# EAGLE design intertubeClock (EAGLE 7.6.0)

## Sheet 1 of 4
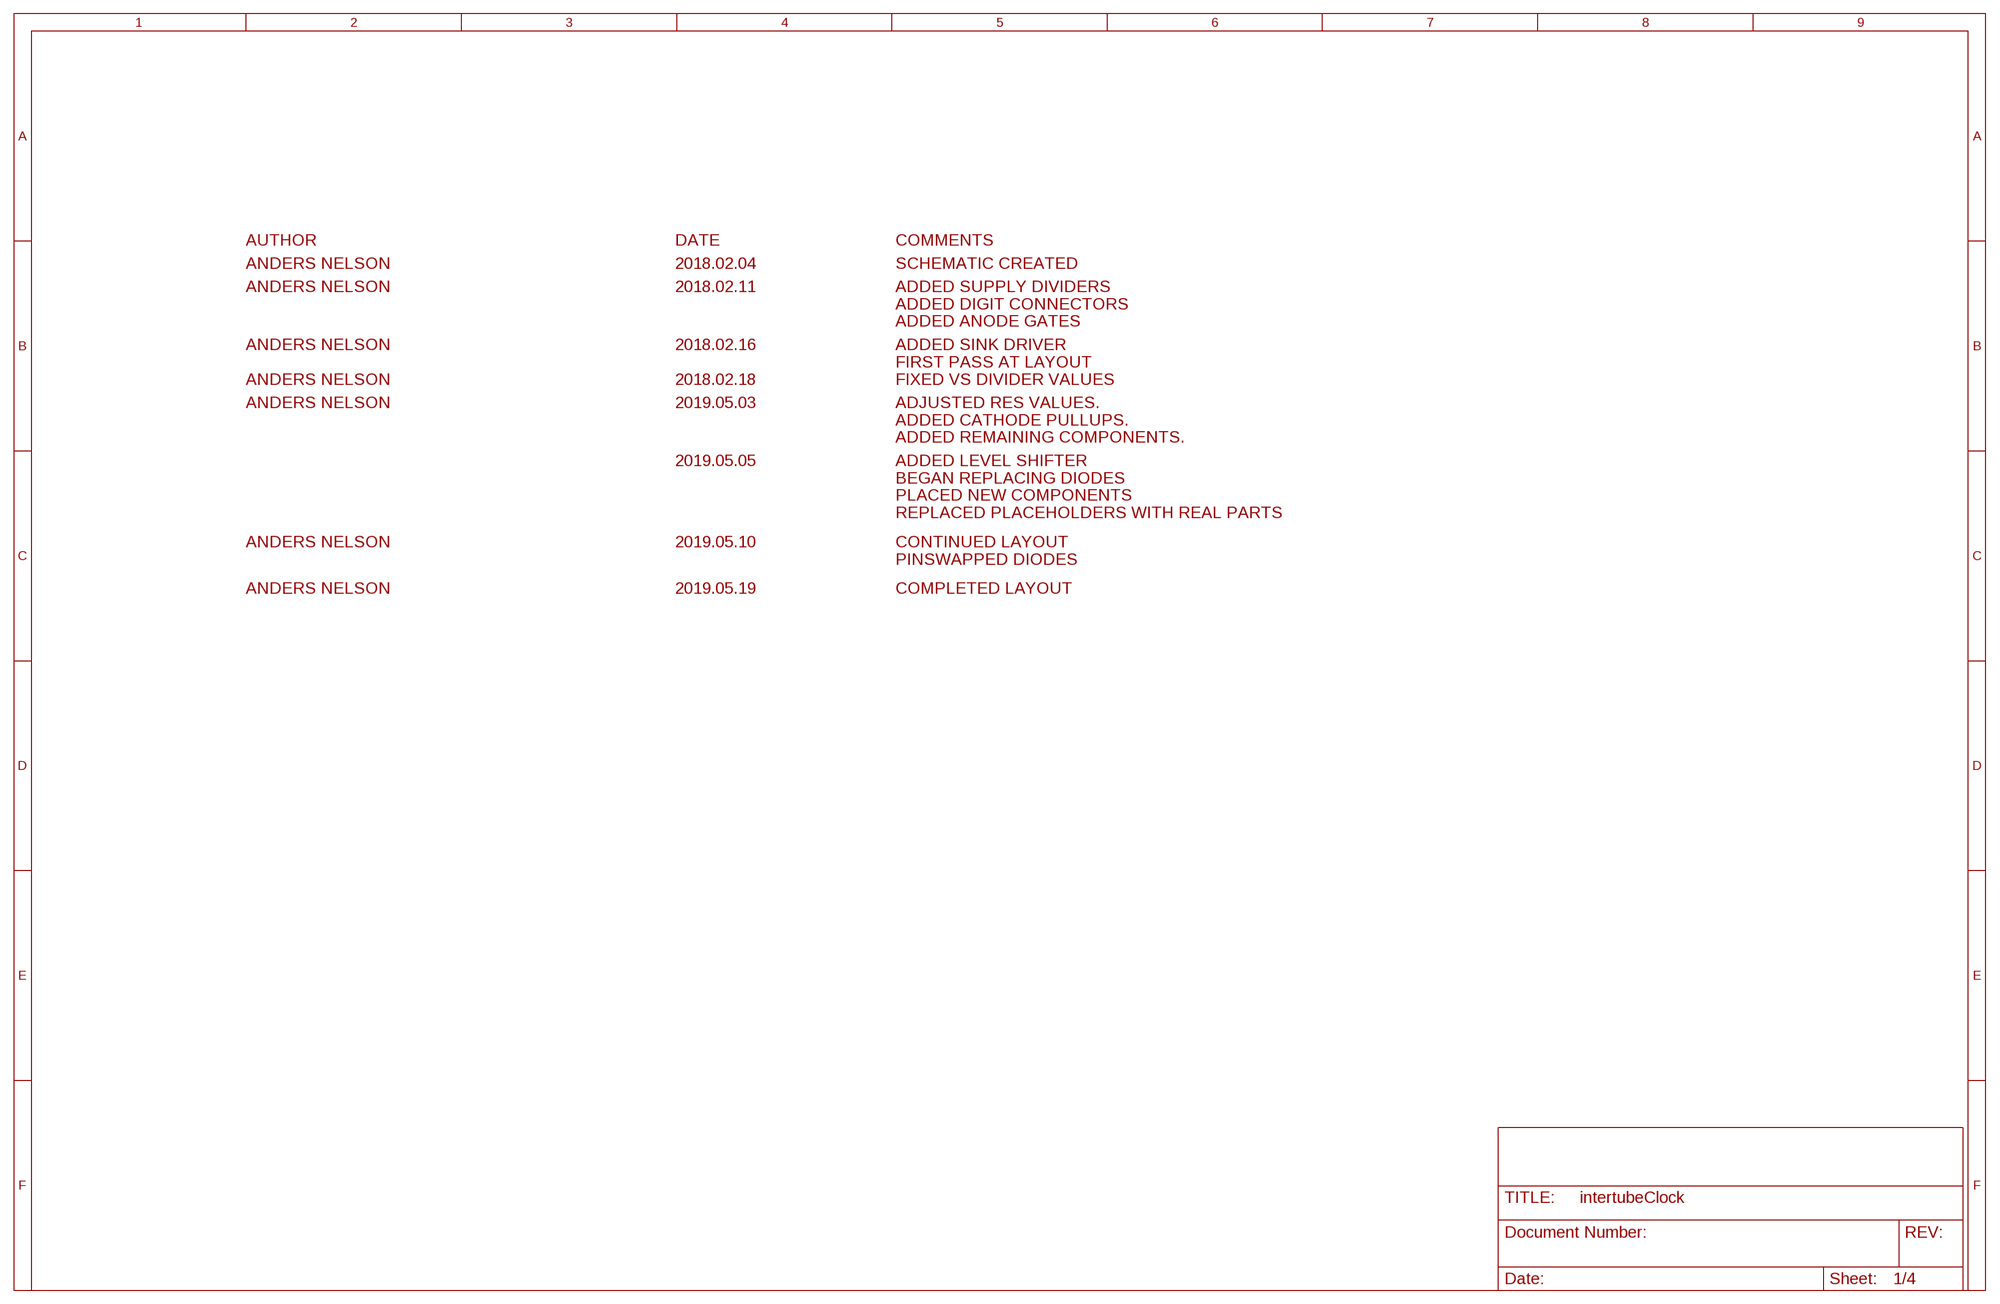
[diagram p0: schematic, sheet 1]

### Notes on the sheet
- AUTHOR | DATE | COMMENTS
- ANDERS NELSON | 2018.02.04 | SCHEMATIC CREATED
- ADDED SUPPLY DIVIDERS
  ADDED DIGIT CONNECTORS
  ADDED ANODE GATES
- ANDERS NELSON | 2018.02.11
- ADDED SINK DRIVER
  FIRST PASS AT LAYOUT
- ANDERS NELSON | 2018.02.16
- FIXED VS DIVIDER VALUES
- ANDERS NELSON | 2018.02.18
- ADJUSTED RES VALUES.
  ADDED CATHODE PULLUPS.
  ADDED REMAINING COMPONENTS.
- ANDERS NELSON | 2019.05.03
- ADDED LEVEL SHIFTER
  BEGAN REPLACING DIODES
  PLACED NEW COMPONENTS
  REPLACED PLACEHOLDERS WITH REAL PARTS
- 2019.05.05
- CONTINUED LAYOUT
  PINSWAPPED DIODES
- ANDERS NELSON | 2019.05.10
- COMPLETED LAYOUT
- ANDERS NELSON | 2019.05.19

## Sheet 2 of 4
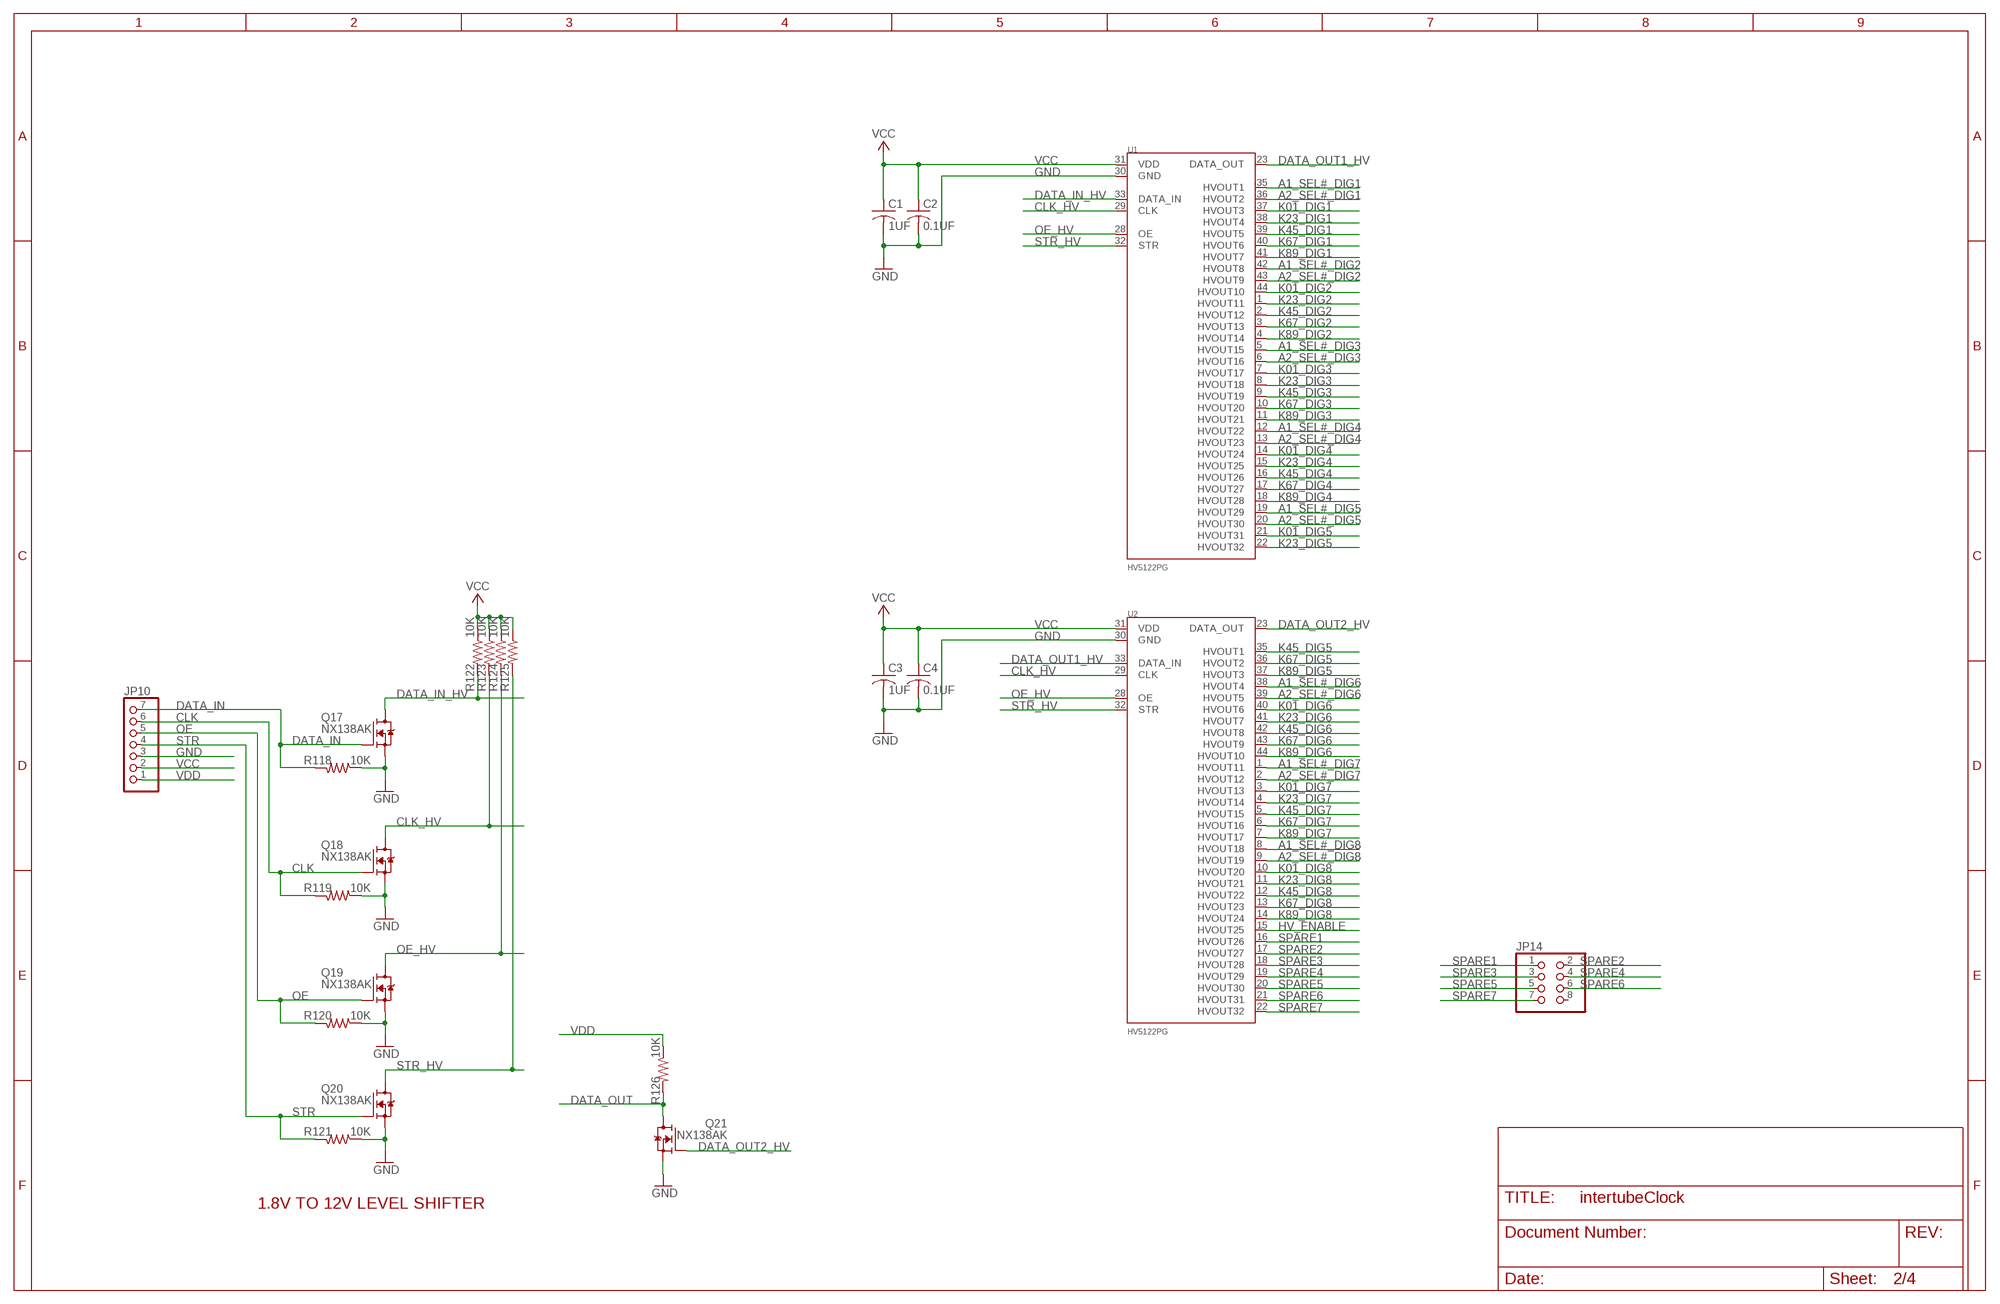
[diagram p1: schematic, sheet 2]

### Parts
C1  1UF  C-USC0805  [C0805]
C2  0.1UF  C-USC0805  [C0805]
C3  1UF  C-USC0805  [C0805]
C4  0.1UF  C-USC0805  [C0805]
JP10  PINHD-1X7  [1X07]
JP14  PINHD-2X4  [2X04]
Q17  NX138AK  [SOT23]
Q18  NX138AK  [SOT23]
Q19  NX138AK  [SOT23]
Q20  NX138AK  [SOT23]
Q21  NX138AK  [SOT23]
R118  10K  R-US_R0603  [R0603]
R119  10K  R-US_R0603  [R0603]
R120  10K  R-US_R0603  [R0603]
R121  10K  R-US_R0603  [R0603]
R122  10K  R-US_R0603  [R0603]
R123  10K  R-US_R0603  [R0603]
R124  10K  R-US_R0603  [R0603]
R125  10K  R-US_R0603  [R0603]
R126  10K  R-US_R0603  [R0603]
U1  HV5122PG  [TQFP44]
U2  HV5122PG  [TQFP44]

### Nets
A1_SEL#_DIG1: U1.35(HVOUT1) ; also sheet 4
A1_SEL#_DIG2: U1.42(HVOUT8) ; also sheet 4
A1_SEL#_DIG3: U1.5(HVOUT15) ; also sheet 4
A1_SEL#_DIG4: U1.12(HVOUT22) ; also sheet 4
A1_SEL#_DIG5: U1.19(HVOUT29) ; also sheet 4
A1_SEL#_DIG6: U2.38(HVOUT4) ; also sheet 4
A1_SEL#_DIG7: U2.1(HVOUT11) ; also sheet 4
A1_SEL#_DIG8: U2.8(HVOUT18) ; also sheet 4
A2_SEL#_DIG1: U1.36(HVOUT2) ; also sheet 4
A2_SEL#_DIG2: U1.43(HVOUT9) ; also sheet 4
A2_SEL#_DIG3: U1.6(HVOUT16) ; also sheet 4
A2_SEL#_DIG4: U1.13(HVOUT23) ; also sheet 4
A2_SEL#_DIG5: U1.20(HVOUT30) ; also sheet 4
A2_SEL#_DIG6: U2.39(HVOUT5) ; also sheet 4
A2_SEL#_DIG7: U2.2(HVOUT12) ; also sheet 4
A2_SEL#_DIG8: U2.9(HVOUT19) ; also sheet 4
CLK: JP10.6 Q18.1(G) R119.2
CLK_HV: Q18.3(D) R123.2 U1.29(CLK) U2.29(CLK)
DATA_IN: JP10.7 Q17.1(G) R118.2
DATA_IN_HV: Q17.3(D) R122.2 U1.33(DATA_IN)
DATA_OUT: Q21.3(D) R126.2
DATA_OUT1_HV: U1.23(DATA_OUT) U2.33(DATA_IN)
DATA_OUT2_HV: Q21.1(G) U2.23(DATA_OUT)
GND: C1.2 C2.2 C3.2 C4.2 JP10.3 Q17.2(S) Q18.2(S) Q19.2(S) Q20.2(S) Q21.2(S) R118.1 R119.1 R120.1 R121.1 U1.30(GND) U2.30(GND) ; also sheet 3
HV_ENABLE: U2.15(HVOUT25)
K01_DIG1: U1.37(HVOUT3) ; also sheet 3
K01_DIG2: U1.44(HVOUT10) ; also sheet 3
K01_DIG3: U1.7(HVOUT17) ; also sheet 3
K01_DIG4: U1.14(HVOUT24) ; also sheet 3
K01_DIG5: U1.21(HVOUT31) ; also sheet 3
K01_DIG6: U2.40(HVOUT6) ; also sheet 3
K01_DIG7: U2.3(HVOUT13) ; also sheet 3
K01_DIG8: U2.10(HVOUT20) ; also sheet 3
K23_DIG1: U1.38(HVOUT4) ; also sheet 3
K23_DIG2: U1.1(HVOUT11) ; also sheet 3
K23_DIG3: U1.8(HVOUT18) ; also sheet 3
K23_DIG4: U1.15(HVOUT25) ; also sheet 3
K23_DIG5: U1.22(HVOUT32) ; also sheet 3
K23_DIG6: U2.41(HVOUT7) ; also sheet 3
K23_DIG7: U2.4(HVOUT14) ; also sheet 3
K23_DIG8: U2.11(HVOUT21) ; also sheet 3
K45_DIG1: U1.39(HVOUT5) ; also sheet 3
K45_DIG2: U1.2(HVOUT12) ; also sheet 3
K45_DIG3: U1.9(HVOUT19) ; also sheet 3
K45_DIG4: U1.16(HVOUT26) ; also sheet 3
K45_DIG5: U2.35(HVOUT1) ; also sheet 3
K45_DIG6: U2.42(HVOUT8) ; also sheet 3
K45_DIG7: U2.5(HVOUT15) ; also sheet 3
K45_DIG8: U2.12(HVOUT22) ; also sheet 3
K67_DIG1: U1.40(HVOUT6) ; also sheet 3
K67_DIG2: U1.3(HVOUT13) ; also sheet 3
K67_DIG3: U1.10(HVOUT20) ; also sheet 3
K67_DIG4: U1.17(HVOUT27) ; also sheet 3
K67_DIG5: U2.36(HVOUT2) ; also sheet 3
K67_DIG6: U2.43(HVOUT9) ; also sheet 3
K67_DIG7: U2.6(HVOUT16) ; also sheet 3
K67_DIG8: U2.13(HVOUT23) ; also sheet 3
K89_DIG1: U1.41(HVOUT7) ; also sheet 3
K89_DIG2: U1.4(HVOUT14) ; also sheet 3
K89_DIG3: U1.11(HVOUT21) ; also sheet 3
K89_DIG4: U1.18(HVOUT28) ; also sheet 3
K89_DIG5: U2.37(HVOUT3) ; also sheet 3
K89_DIG6: U2.44(HVOUT10) ; also sheet 3
K89_DIG7: U2.7(HVOUT17) ; also sheet 3
K89_DIG8: U2.14(HVOUT24) ; also sheet 3
OE: JP10.5 Q19.1(G) R120.2
OE_HV: Q19.3(D) R124.2 U1.28(OE) U2.28(OE)
SPARE1: JP14.1 U2.16(HVOUT26)
SPARE2: JP14.2 U2.17(HVOUT27)
SPARE3: JP14.3 U2.18(HVOUT28)
SPARE4: JP14.4 U2.19(HVOUT29)
SPARE5: JP14.5 U2.20(HVOUT30)
SPARE6: JP14.6 U2.21(HVOUT31)
SPARE7: JP14.7 U2.22(HVOUT32)
STR: JP10.4 Q20.1(G) R121.2
STR_HV: Q20.3(D) R125.2 U1.32(STR) U2.32(STR)
VCC: C1.1 C2.1 C3.1 C4.1 JP10.2 R122.1 R123.1 R124.1 R125.1 U1.31(VDD) U2.31(VDD)
VDD: JP10.1 R126.1
Unconnected: JP14.8

### Notes on the sheet
- 1.8V TO 12V LEVEL SHIFTER

## Sheet 3 of 4
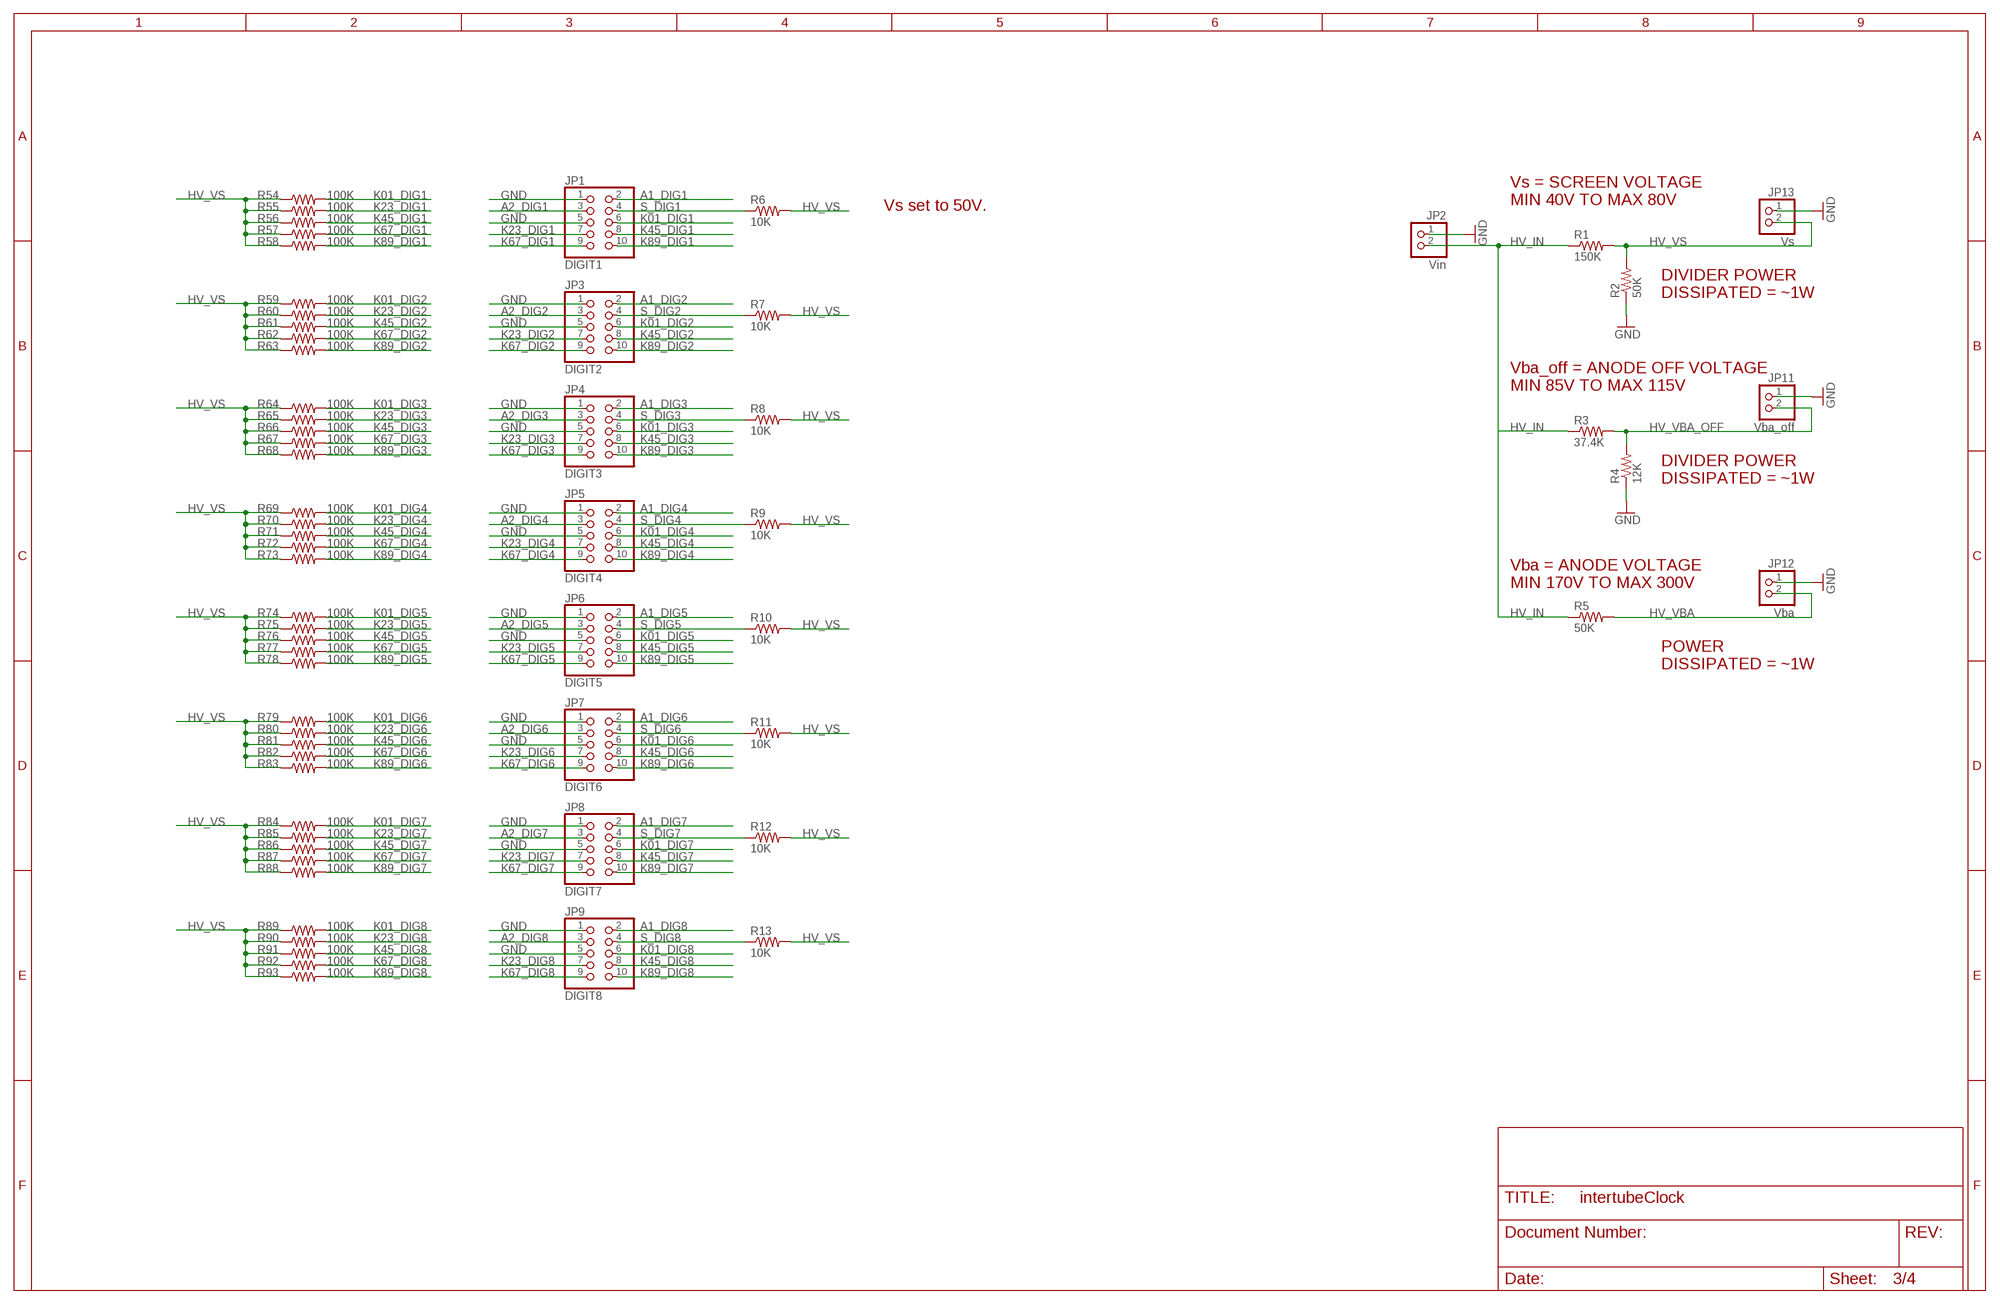
[diagram p2: schematic, sheet 3]

### Parts
JP1  DIGIT1  PINHD-2X5  [2X05]
JP2  Vin  PINHD-1X2  [1X02]
JP3  DIGIT2  PINHD-2X5  [2X05]
JP4  DIGIT3  PINHD-2X5  [2X05]
JP5  DIGIT4  PINHD-2X5  [2X05]
JP6  DIGIT5  PINHD-2X5  [2X05]
JP7  DIGIT6  PINHD-2X5  [2X05]
JP8  DIGIT7  PINHD-2X5  [2X05]
JP9  DIGIT8  PINHD-2X5  [2X05]
JP11  Vba_off  PINHD-1X2  [1X02]
JP12  Vba  PINHD-1X2  [1X02]
JP13  Vs  PINHD-1X2  [1X02]
R1  150K  R-US_R2512  [R2512]
R2  50K  R-US_R2512  [R2512]
R3  37.4K  R-US_R2512  [R2512]
R4  12K  R-US_R2512  [R2512]
R5  50K  R-US_R2512  [R2512]
R6  10K  R-US_R1206  [R1206]
R7  10K  R-US_R1206  [R1206]
R8  10K  R-US_R1206  [R1206]
R9  10K  R-US_R1206  [R1206]
R10  10K  R-US_R1206  [R1206]
R11  10K  R-US_R1206  [R1206]
R12  10K  R-US_R1206  [R1206]
R13  10K  R-US_R1206  [R1206]
R54  100K  R-US_R1206  [R1206]
R55  100K  R-US_R1206  [R1206]
R56  100K  R-US_R1206  [R1206]
R57  100K  R-US_R1206  [R1206]
R58  100K  R-US_R1206  [R1206]
R59  100K  R-US_R1206  [R1206]
R60  100K  R-US_R1206  [R1206]
R61  100K  R-US_R1206  [R1206]
R62  100K  R-US_R1206  [R1206]
R63  100K  R-US_R1206  [R1206]
R64  100K  R-US_R1206  [R1206]
R65  100K  R-US_R1206  [R1206]
R66  100K  R-US_R1206  [R1206]
R67  100K  R-US_R1206  [R1206]
R68  100K  R-US_R1206  [R1206]
R69  100K  R-US_R1206  [R1206]
R70  100K  R-US_R1206  [R1206]
R71  100K  R-US_R1206  [R1206]
R72  100K  R-US_R1206  [R1206]
R73  100K  R-US_R1206  [R1206]
R74  100K  R-US_R1206  [R1206]
R75  100K  R-US_R1206  [R1206]
R76  100K  R-US_R1206  [R1206]
R77  100K  R-US_R1206  [R1206]
R78  100K  R-US_R1206  [R1206]
R79  100K  R-US_R1206  [R1206]
R80  100K  R-US_R1206  [R1206]
R81  100K  R-US_R1206  [R1206]
R82  100K  R-US_R1206  [R1206]
R83  100K  R-US_R1206  [R1206]
R84  100K  R-US_R1206  [R1206]
R85  100K  R-US_R1206  [R1206]
R86  100K  R-US_R1206  [R1206]
R87  100K  R-US_R1206  [R1206]
R88  100K  R-US_R1206  [R1206]
R89  100K  R-US_R1206  [R1206]
R90  100K  R-US_R1206  [R1206]
R91  100K  R-US_R1206  [R1206]
R92  100K  R-US_R1206  [R1206]
R93  100K  R-US_R1206  [R1206]

### Nets
A1_DIG1: JP1.2 ; also sheet 4
A1_DIG2: JP3.2 ; also sheet 4
A1_DIG3: JP4.2 ; also sheet 4
A1_DIG4: JP5.2 ; also sheet 4
A1_DIG5: JP6.2 ; also sheet 4
A1_DIG6: JP7.2 ; also sheet 4
A1_DIG7: JP8.2 ; also sheet 4
A1_DIG8: JP9.2 ; also sheet 4
A2_DIG1: JP1.3 ; also sheet 4
A2_DIG2: JP3.3 ; also sheet 4
A2_DIG3: JP4.3 ; also sheet 4
A2_DIG4: JP5.3 ; also sheet 4
A2_DIG5: JP6.3 ; also sheet 4
A2_DIG6: JP7.3 ; also sheet 4
A2_DIG7: JP8.3 ; also sheet 4
A2_DIG8: JP9.3 ; also sheet 4
GND: JP1.1 JP1.5 JP2.1 JP3.1 JP3.5 JP4.1 JP4.5 JP5.1 JP5.5 JP6.1 JP6.5 JP7.1 JP7.5 JP8.1 JP8.5 JP9.1 JP9.5 JP11.1 JP12.1 JP13.1 R2.1 R4.1 ; also sheet 2
HV_IN: JP2.2 R1.1 R3.1 R5.1
HV_VBA: JP12.2 R5.2 ; also sheet 4
HV_VBA_OFF: JP11.2 R3.2 R4.2 ; also sheet 4
HV_VS: JP13.2 R1.2 R2.2 R6.2 R7.2 R8.2 R9.2 R10.2 R11.2 R12.2 R13.2 R54.1 R55.1 R56.1 R57.1 R58.1 R59.1 R60.1 R61.1 R62.1 R63.1 R64.1 R65.1 R66.1 R67.1 R68.1 R69.1 R70.1 R71.1 R72.1 R73.1 R74.1 R75.1 R76.1 R77.1 R78.1 R79.1 R80.1 R81.1 R82.1 R83.1 R84.1 R85.1 R86.1 R87.1 R88.1 R89.1 R90.1 R91.1 R92.1 R93.1
K01_DIG1: JP1.6 R54.2 ; also sheet 2
K01_DIG2: JP3.6 R59.2 ; also sheet 2
K01_DIG3: JP4.6 R64.2 ; also sheet 2
K01_DIG4: JP5.6 R69.2 ; also sheet 2
K01_DIG5: JP6.6 R74.2 ; also sheet 2
K01_DIG6: JP7.6 R79.2 ; also sheet 2
K01_DIG7: JP8.6 R84.2 ; also sheet 2
K01_DIG8: JP9.6 R89.2 ; also sheet 2
K23_DIG1: JP1.7 R55.2 ; also sheet 2
K23_DIG2: JP3.7 R60.2 ; also sheet 2
K23_DIG3: JP4.7 R65.2 ; also sheet 2
K23_DIG4: JP5.7 R70.2 ; also sheet 2
K23_DIG5: JP6.7 R75.2 ; also sheet 2
K23_DIG6: JP7.7 R80.2 ; also sheet 2
K23_DIG7: JP8.7 R85.2 ; also sheet 2
K23_DIG8: JP9.7 R90.2 ; also sheet 2
K45_DIG1: JP1.8 R56.2 ; also sheet 2
K45_DIG2: JP3.8 R61.2 ; also sheet 2
K45_DIG3: JP4.8 R66.2 ; also sheet 2
K45_DIG4: JP5.8 R71.2 ; also sheet 2
K45_DIG5: JP6.8 R76.2 ; also sheet 2
K45_DIG6: JP7.8 R81.2 ; also sheet 2
K45_DIG7: JP8.8 R86.2 ; also sheet 2
K45_DIG8: JP9.8 R91.2 ; also sheet 2
K67_DIG1: JP1.9 R57.2 ; also sheet 2
K67_DIG2: JP3.9 R62.2 ; also sheet 2
K67_DIG3: JP4.9 R67.2 ; also sheet 2
K67_DIG4: JP5.9 R72.2 ; also sheet 2
K67_DIG5: JP6.9 R77.2 ; also sheet 2
K67_DIG6: JP7.9 R82.2 ; also sheet 2
K67_DIG7: JP8.9 R87.2 ; also sheet 2
K67_DIG8: JP9.9 R92.2 ; also sheet 2
K89_DIG1: JP1.10 R58.2 ; also sheet 2
K89_DIG2: JP3.10 R63.2 ; also sheet 2
K89_DIG3: JP4.10 R68.2 ; also sheet 2
K89_DIG4: JP5.10 R73.2 ; also sheet 2
K89_DIG5: JP6.10 R78.2 ; also sheet 2
K89_DIG6: JP7.10 R83.2 ; also sheet 2
K89_DIG7: JP8.10 R88.2 ; also sheet 2
K89_DIG8: JP9.10 R93.2 ; also sheet 2
S_DIG1: JP1.4 R6.1
S_DIG2: JP3.4 R7.1
S_DIG3: JP4.4 R8.1
S_DIG4: JP5.4 R9.1
S_DIG5: JP6.4 R10.1
S_DIG6: JP7.4 R11.1
S_DIG7: JP8.4 R12.1
S_DIG8: JP9.4 R13.1

### Notes on the sheet
- Vs = SCREEN VOLTAGE
  MIN 40V TO MAX 80V
- Vs set to 50V.
- DIVIDER POWER
  DISSIPATED = ~1W
- Vba_off = ANODE OFF VOLTAGE
  MIN 85V TO MAX 115V
- DIVIDER POWER
  DISSIPATED = ~1W
- Vba = ANODE VOLTAGE
  MIN 170V TO MAX 300V
- POWER
  DISSIPATED = ~1W

## Sheet 4 of 4
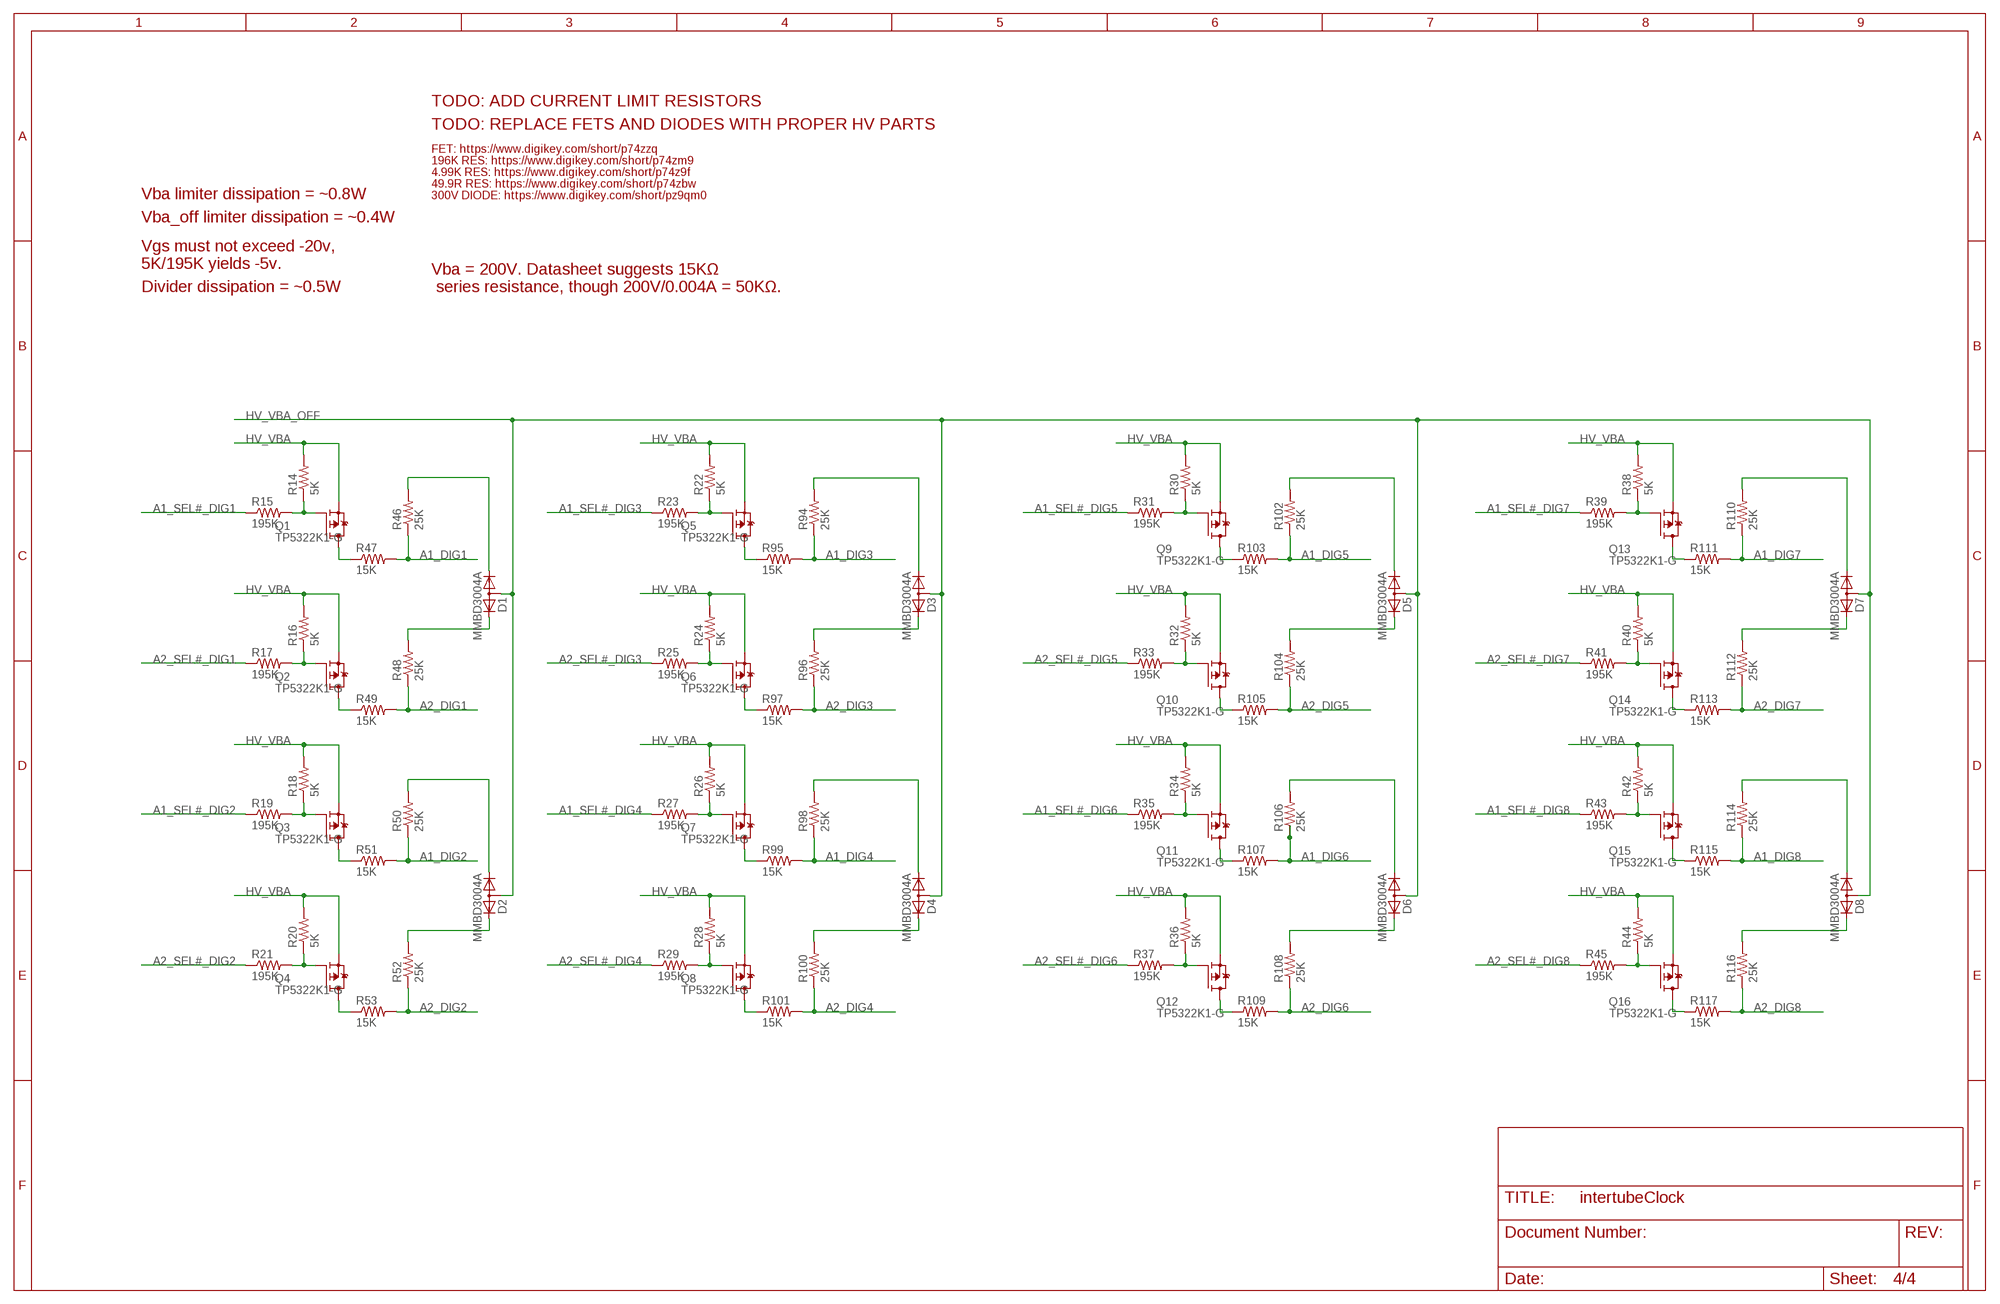
[diagram p3: schematic, sheet 4]

### Parts
D1  MMBD3004A  [SOT23]
D2  MMBD3004A  [SOT23]
D3  MMBD3004A  [SOT23]
D4  MMBD3004A  [SOT23]
D5  MMBD3004A  [SOT23]
D6  MMBD3004A  [SOT23]
D7  MMBD3004A  [SOT23]
D8  MMBD3004A  [SOT23]
Q1  TP5322K1-G  [SOT23]
Q2  TP5322K1-G  [SOT23]
Q3  TP5322K1-G  [SOT23]
Q4  TP5322K1-G  [SOT23]
Q5  TP5322K1-G  [SOT23]
Q6  TP5322K1-G  [SOT23]
Q7  TP5322K1-G  [SOT23]
Q8  TP5322K1-G  [SOT23]
Q9  TP5322K1-G  [SOT23]
Q10  TP5322K1-G  [SOT23]
Q11  TP5322K1-G  [SOT23]
Q12  TP5322K1-G  [SOT23]
Q13  TP5322K1-G  [SOT23]
Q14  TP5322K1-G  [SOT23]
Q15  TP5322K1-G  [SOT23]
Q16  TP5322K1-G  [SOT23]
R14  5K  R-US_R1206  [R1206]
R15  195K  R-US_R1206  [R1206]
R16  5K  R-US_R1206  [R1206]
R17  195K  R-US_R1206  [R1206]
R18  5K  R-US_R1206  [R1206]
R19  195K  R-US_R1206  [R1206]
R20  5K  R-US_R1206  [R1206]
R21  195K  R-US_R1206  [R1206]
R22  5K  R-US_R1206  [R1206]
R23  195K  R-US_R1206  [R1206]
R24  5K  R-US_R1206  [R1206]
R25  195K  R-US_R1206  [R1206]
R26  5K  R-US_R1206  [R1206]
R27  195K  R-US_R1206  [R1206]
R28  5K  R-US_R1206  [R1206]
R29  195K  R-US_R1206  [R1206]
R30  5K  R-US_R1206  [R1206]
R31  195K  R-US_R1206  [R1206]
R32  5K  R-US_R1206  [R1206]
R33  195K  R-US_R1206  [R1206]
R34  5K  R-US_R1206  [R1206]
R35  195K  R-US_R1206  [R1206]
R36  5K  R-US_R1206  [R1206]
R37  195K  R-US_R1206  [R1206]
R38  5K  R-US_R1206  [R1206]
R39  195K  R-US_R1206  [R1206]
R40  5K  R-US_R1206  [R1206]
R41  195K  R-US_R1206  [R1206]
R42  5K  R-US_R1206  [R1206]
R43  195K  R-US_R1206  [R1206]
R44  5K  R-US_R1206  [R1206]
R45  195K  R-US_R1206  [R1206]
R46  25K  R-US_R1206  [R1206]
R47  15K  R-US_R1206  [R1206]
R48  25K  R-US_R1206  [R1206]
R49  15K  R-US_R1206  [R1206]
R50  25K  R-US_R1206  [R1206]
R51  15K  R-US_R1206  [R1206]
R52  25K  R-US_R1206  [R1206]
R53  15K  R-US_R1206  [R1206]
R94  25K  R-US_R1206  [R1206]
R95  15K  R-US_R1206  [R1206]
R96  25K  R-US_R1206  [R1206]
R97  15K  R-US_R1206  [R1206]
R98  25K  R-US_R1206  [R1206]
R99  15K  R-US_R1206  [R1206]
R100  25K  R-US_R1206  [R1206]
R101  15K  R-US_R1206  [R1206]
R102  25K  R-US_R1206  [R1206]
R103  15K  R-US_R1206  [R1206]
R104  25K  R-US_R1206  [R1206]
R105  15K  R-US_R1206  [R1206]
R106  25K  R-US_R1206  [R1206]
R107  15K  R-US_R1206  [R1206]
R108  25K  R-US_R1206  [R1206]
R109  15K  R-US_R1206  [R1206]
R110  25K  R-US_R1206  [R1206]
R111  15K  R-US_R1206  [R1206]
R112  25K  R-US_R1206  [R1206]
R113  15K  R-US_R1206  [R1206]
R114  25K  R-US_R1206  [R1206]
R115  15K  R-US_R1206  [R1206]
R116  25K  R-US_R1206  [R1206]
R117  15K  R-US_R1206  [R1206]

### Nets
A1_DIG1: R46.1 R47.2 ; also sheet 3
A1_DIG2: R50.1 R51.2 ; also sheet 3
A1_DIG3: R94.1 R95.2 ; also sheet 3
A1_DIG4: R98.1 R99.2 ; also sheet 3
A1_DIG5: R102.1 R103.2 ; also sheet 3
A1_DIG6: R106.1 R107.2 ; also sheet 3
A1_DIG7: R110.1 R111.2 ; also sheet 3
A1_DIG8: R114.1 R115.2 ; also sheet 3
A1_SEL#_DIG1: R15.1 ; also sheet 2
A1_SEL#_DIG2: R19.1 ; also sheet 2
A1_SEL#_DIG3: R23.1 ; also sheet 2
A1_SEL#_DIG4: R27.1 ; also sheet 2
A1_SEL#_DIG5: R31.1 ; also sheet 2
A1_SEL#_DIG6: R35.1 ; also sheet 2
A1_SEL#_DIG7: R39.1 ; also sheet 2
A1_SEL#_DIG8: R43.1 ; also sheet 2
A2_DIG1: R48.1 R49.2 ; also sheet 3
A2_DIG2: R52.1 R53.2 ; also sheet 3
A2_DIG3: R96.1 R97.2 ; also sheet 3
A2_DIG4: R100.1 R101.2 ; also sheet 3
A2_DIG5: R104.1 R105.2 ; also sheet 3
A2_DIG6: R108.1 R109.2 ; also sheet 3
A2_DIG7: R112.1 R113.2 ; also sheet 3
A2_DIG8: R116.1 R117.2 ; also sheet 3
A2_SEL#_DIG1: R17.1 ; also sheet 2
A2_SEL#_DIG2: R21.1 ; also sheet 2
A2_SEL#_DIG3: R25.1 ; also sheet 2
A2_SEL#_DIG4: R29.1 ; also sheet 2
A2_SEL#_DIG5: R33.1 ; also sheet 2
A2_SEL#_DIG6: R37.1 ; also sheet 2
A2_SEL#_DIG7: R41.1 ; also sheet 2
A2_SEL#_DIG8: R45.1 ; also sheet 2
HV_VBA: Q1.2(S) Q2.2(S) Q3.2(S) Q4.2(S) Q5.2(S) Q6.2(S) Q7.2(S) Q8.2(S) Q9.2(S) Q10.2(S) Q11.2(S) Q12.2(S) Q13.2(S) Q14.2(S) Q15.2(S) Q16.2(S) R14.2 R16.2 R18.2 R20.2 R22.2 R24.2 R26.2 R28.2 R30.2 R32.2 R34.2 R36.2 R38.2 R40.2 R42.2 R44.2 ; also sheet 3
HV_VBA_OFF: D1.3(A) D2.3(A) D3.3(A) D4.3(A) D5.3(A) D6.3(A) D7.3(A) D8.3(A) ; also sheet 3
N$1: Q1.1(G) R14.1 R15.2
N$2: Q2.1(G) R16.1 R17.2
N$3: Q3.1(G) R18.1 R19.2
N$4: Q4.1(G) R20.1 R21.2
N$5: Q5.1(G) R22.1 R23.2
N$6: Q6.1(G) R24.1 R25.2
N$7: Q7.1(G) R26.1 R27.2
N$8: Q8.1(G) R28.1 R29.2
N$9: Q9.1(G) R30.1 R31.2
N$10: Q10.1(G) R32.1 R33.2
N$11: Q11.1(G) R34.1 R35.2
N$12: Q12.1(G) R36.1 R37.2
N$13: Q13.1(G) R38.1 R39.2
N$14: Q14.1(G) R40.1 R41.2
N$15: Q15.1(G) R42.1 R43.2
N$16: Q16.1(G) R44.1 R45.2
N$17: Q1.3(D) R47.1
N$18: D1.1(K1) R46.2
N$19: Q2.3(D) R49.1
N$20: D1.2(K2) R48.2
N$21: Q3.3(D) R51.1
N$22: D2.1(K1) R50.2
N$24: Q4.3(D) R53.1
N$25: D2.2(K2) R52.2
N$26: D3.1(K1) R94.2
N$27: D3.2(K2) R96.2
N$28: D4.1(K1) R98.2
N$29: D4.2(K2) R100.2
N$30: Q9.3(D) R103.1
N$31: D5.1(K1) R102.2
N$32: D5.2(K2) R104.2
N$33: D6.1(K1) R106.2
N$34: D6.2(K2) R108.2
N$35: Q13.3(D) R111.1
N$36: D7.1(K1) R110.2
N$37: D7.2(K2) R112.2
N$38: D8.1(K1) R114.2
N$39: D8.2(K2) R116.2
N$41: Q5.3(D) R95.1
N$42: Q6.3(D) R97.1
N$43: Q7.3(D) R99.1
N$44: Q8.3(D) R101.1
N$45: Q10.3(D) R105.1
N$46: Q11.3(D) R107.1
N$47: Q12.3(D) R109.1
N$48: Q14.3(D) R113.1
N$49: Q15.3(D) R115.1
N$50: Q16.3(D) R117.1

### Notes on the sheet
- TODO: ADD CURRENT LIMIT RESISTORS
- TODO: REPLACE FETS AND DIODES WITH PROPER HV PARTS
- FET: https://www.digikey.com/short/p74zzq
- 196K RES: https://www.digikey.com/short/p74zm9
- 4.99K RES: https://www.digikey.com/short/p74z9f
- 49.9R RES: https://www.digikey.com/short/p74zbw
- Vba limiter dissipation = ~0.8W | 300V DIODE: https://www.digikey.com/short/pz9qm0
- Vba_off limiter dissipation = ~0.4W
- Vgs must not exceed -20v,
  5K/195K yields -5v.
- Divider dissipation = ~0.5W
- Vba = 200V. Datasheet suggests 15KΩ
   series resistance, though 200V/0.004A = 50KΩ.

## Library data of the parts
C1-C4 = rcl:C-US: CAPACITOR, American symbol
D1-D8 = intertubeClock:MMBD3004*
JP1 JP3-JP9 = pinhead:PINHD-2X5: PIN HEADER
JP2 JP11-JP13 = pinhead:PINHD-1X2: PIN HEADER
JP10 = pinhead:PINHD-1X7: PIN HEADER
JP14 = pinhead:PINHD-2X4: PIN HEADER
Q1-Q16 = intertubeClock:TP5322
Q17-Q21 = intertubeClock:NX138AK
R1-R126 = rcl:R-US_: RESISTOR, American symbol
U1 U2 = intertubeClock:HV5*

## Board
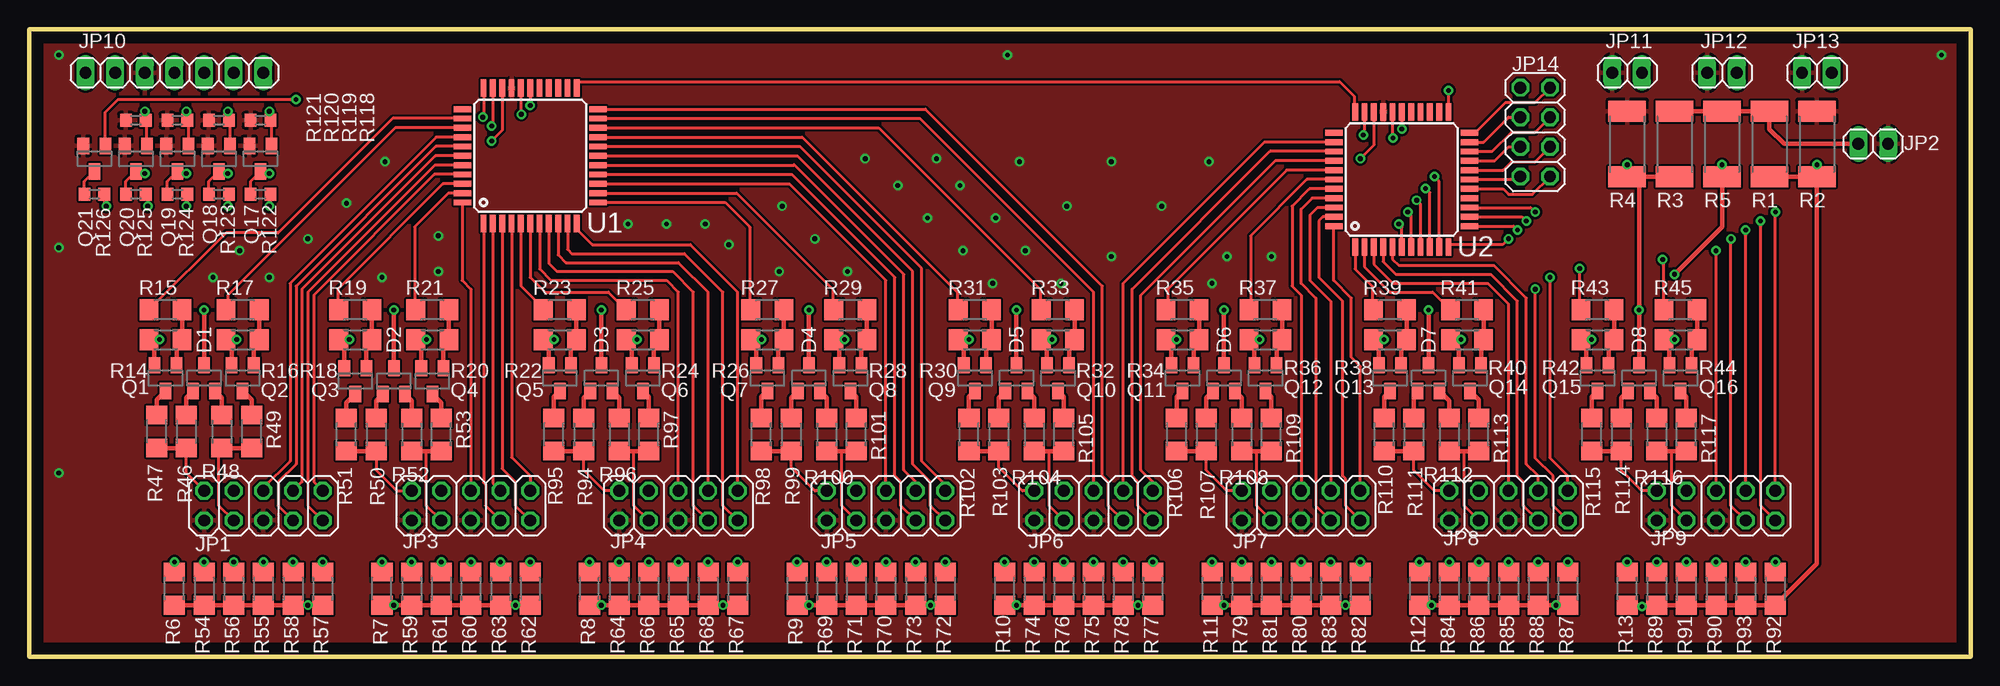
[diagram p4: board, top side]
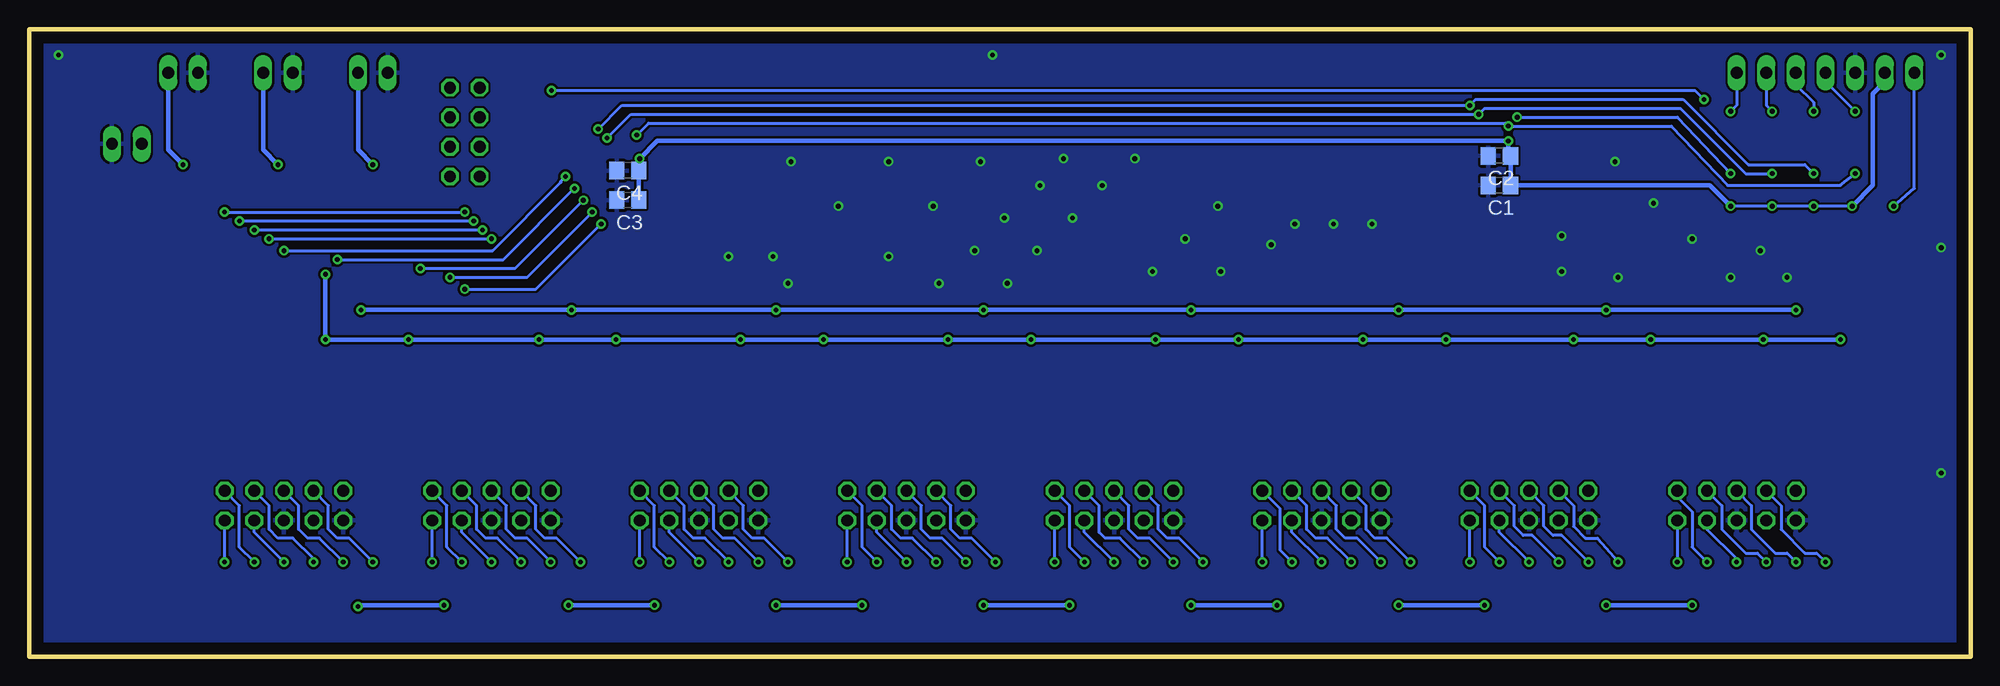
[diagram p5: board, bottom side, seen from below]

Size 166.35 x 53.77 mm. Coordinates in mm from the lower left corner, seen from the top.
Outline: 0,0 166.35,0 166.35,53.77 0,53.77 0,0
Copper layers (1*16): Top 0.035mm / dielectric 1.5mm / Bottom 0.035mm
Design rules "default": minimum track width 10mil, minimum drill 24mil, track to track 8mil, track to pad 8mil, pad to pad 8mil, via to via 8mil, smd to smd 8mil, copper to edge 40mil, drill to drill 8mil, minimum pad ring 10mil, minimum via ring 8mil, stop-mask expansion 4mil, vias tented up to drill 0mil, thermal gap 10mil

### Footprints (pad centres in the part's own frame; a part is rotated, then mirrored left to right if it is on the bottom)
C0805 = smd 1.3 x 1.5: 1 -0.95,0; 2 0.95,0
SOT23 = smd 1 x 1.4: 1 -0.95,-1.1; 2 0.95,-1.1; 3 0,1.1
2X05 = drill 1.016 octagon: 1 -5.08,-1.27; 2 -5.08,1.27; 3 -2.54,-1.27; 4 -2.54,1.27; 5 0,-1.27; 6 0,1.27; 7 2.54,-1.27; 8 2.54,1.27; 9 5.08,-1.27; 10 5.08,1.27
1X02 = drill 1.016 long: 1 -1.27,0; 2 1.27,0
1X07 = drill 1.016 long: 1 -7.62,0; 2 -5.08,0; 3 -2.54,0; 4 0,0; 5 2.54,0; 6 5.08,0; 7 7.62,0
2X04 = drill 1.016 octagon: 1 -3.81,-1.27; 2 -3.81,1.27; 3 -1.27,-1.27; 4 -1.27,1.27; 5 1.27,-1.27; 6 1.27,1.27; 7 3.81,-1.27; 8 3.81,1.27
R2512 = smd 1.8 x 3.2: 1 -2.8,0; 2 2.8,0
R1206 = smd 1.6 x 1.803: 1 -1.422,0; 2 1.422,0
R0603 = smd 1 x 1.1: 1 -0.85,0; 2 0.85,0
TQFP44 = smd 1.5 x 0.5: 1 -5.8,4; 2 -5.8,3.2; 3 -5.8,2.4; 4 -5.8,1.6; 5 -5.8,0.8; 6 -5.8,0; 7 -5.8,-0.8; 8 -5.8,-1.6; 9 -5.8,-2.4; 10 -5.8,-3.2; 11 -5.8,-4; 23 5.8,-4; 24 5.8,-3.2; 25 5.8,-2.4; 26 5.8,-1.6; 27 5.8,-0.8; 28 5.8,0; 29 5.8,0.8; 30 5.8,1.6; 31 5.8,2.4; 32 5.8,3.2; 33 5.8,4 | smd 0.5 x 1.5: 12 -4,-5.8; 13 -3.2,-5.8; 14 -2.4,-5.8; 15 -1.6,-5.8; 16 -0.8,-5.8; 17 0,-5.8; 18 0.8,-5.8; 19 1.6,-5.8; 20 2.4,-5.8; 21 3.2,-5.8; 22 4,-5.8; 34 4,5.8; 35 3.2,5.8; 36 2.4,5.8; 37 1.6,5.8; 38 0.8,5.8; 39 0,5.8; 40 -0.8,5.8; 41 -1.6,5.8; 42 -2.4,5.8; 43 -3.2,5.8; 44 -4,5.8

### Placement (x,y rotation side)
C1  40.39,40.39 180 bottom
C2  40.39,42.93 180 bottom
C3  115.06,39.12 180 bottom
C4  115.06,41.66 180 bottom
D1  14.99,23.88 0 top
D2  31.24,23.62 0 top
D3  49.02,23.88 0 top
D4  66.8,23.88 0 top
D5  84.58,23.88 0 top
D6  102.36,23.88 0 top
D7  119.89,23.88 0 top
D8  137.92,23.88 0 top
JP1  20.07,12.95 0 top
JP2  157.99,43.94 180 top
JP3  37.85,12.95 0 top
JP4  55.63,12.95 0 top
JP5  73.41,12.95 0 top
JP6  91.19,12.95 0 top
JP7  108.97,12.95 0 top
JP8  126.75,12.95 0 top
JP9  144.53,12.95 0 top
JP10  12.45,50.04 0 top
JP11  136.91,50.04 0 top
JP12  145.03,50.04 0 top
JP13  153.16,50.04 0 top
JP14  129.03,44.96 90 top
Q1  11.68,23.88 180 top
Q2  18.29,23.88 180 top
Q3  27.94,23.62 180 top
Q4  34.54,23.62 180 top
Q5  45.47,23.88 180 top
Q6  52.58,23.88 180 top
Q7  63.25,23.88 180 top
Q8  70.36,23.88 180 top
Q9  81.03,23.88 180 top
Q10  88.14,23.88 180 top
Q11  98.81,23.88 180 top
Q12  105.92,23.88 180 top
Q13  116.59,23.88 180 top
Q14  123.44,23.88 180 top
Q15  134.37,23.88 180 top
Q16  141.48,23.88 180 top
Q17  19.81,42.67 180 top
Q18  16.26,42.67 180 top
Q19  12.7,42.67 180 top
Q20  9.14,42.67 180 top
Q21  5.59,42.67 180 top
R1  149.1,43.94 270 top
R2  153.16,43.94 270 top
R3  140.97,43.94 270 top
R4  136.91,43.94 270 top
R5  145.03,43.94 270 top
R6  12.45,5.84 270 top
R7  30.23,5.84 270 top
R8  48.01,5.84 270 top
R9  65.79,5.84 270 top
R10  83.57,5.84 270 top
R11  101.35,5.84 270 top
R12  119.13,5.84 270 top
R13  136.91,5.84 270 top
R14  11.68,27.18 180 top
R15  11.68,29.72 0 top
R16  18.29,27.18 180 top
R17  18.29,29.72 0 top
R18  27.94,27.18 180 top
R19  27.94,29.72 0 top
R20  34.54,27.18 180 top
R21  34.54,29.72 0 top
R22  45.47,27.18 180 top
R23  45.47,29.72 0 top
R24  52.58,27.18 180 top
R25  52.58,29.72 0 top
R26  63.25,27.18 180 top
R27  63.25,29.72 0 top
R28  70.36,27.18 180 top
R29  70.36,29.72 0 top
R30  81.03,27.18 180 top
R31  81.03,29.72 0 top
R32  88.14,27.18 180 top
R33  88.14,29.72 0 top
R34  98.81,27.18 180 top
R35  98.81,29.72 0 top
R36  105.92,27.18 180 top
R37  105.92,29.72 0 top
R38  116.59,27.18 180 top
R39  116.59,29.72 0 top
R40  123.19,27.18 180 top
R41  123.19,29.72 0 top
R42  134.37,27.18 180 top
R43  134.37,29.72 0 top
R44  141.48,27.18 180 top
R45  141.48,29.72 0 top
R46  13.46,19.3 90 top
R47  10.92,19.3 270 top
R48  16.51,19.3 90 top
R49  19.05,19.3 270 top
R50  29.72,19.05 90 top
R51  27.18,19.05 270 top
R52  32.77,19.05 90 top
R53  35.31,19.05 270 top
R54  14.99,5.84 90 top
R55  20.07,5.84 90 top
R56  17.53,5.84 90 top
R57  25.15,5.84 90 top
R58  22.61,5.84 90 top
R59  32.77,5.84 90 top
R60  37.85,5.84 90 top
R61  35.31,5.84 90 top
R62  42.93,5.84 90 top
R63  40.39,5.84 90 top
R64  50.55,5.84 90 top
R65  55.63,5.84 90 top
R66  53.09,5.84 90 top
R67  60.71,5.84 90 top
R68  58.17,5.84 90 top
R69  68.33,5.84 90 top
R70  73.41,5.84 90 top
R71  70.87,5.84 90 top
R72  78.49,5.84 90 top
R73  75.95,5.84 90 top
R74  86.11,5.84 90 top
R75  91.19,5.84 90 top
R76  88.65,5.84 90 top
R77  96.27,5.84 90 top
R78  93.73,5.84 90 top
R79  103.89,5.84 90 top
R80  108.97,5.84 90 top
R81  106.43,5.84 90 top
R82  114.05,5.84 90 top
R83  111.51,5.84 90 top
R84  121.67,5.84 90 top
R85  126.75,5.84 90 top
R86  124.21,5.84 90 top
R87  131.83,5.84 90 top
R88  129.29,5.84 90 top
R89  139.45,5.84 90 top
R90  144.53,5.84 90 top
R91  141.99,5.84 90 top
R92  149.61,5.84 90 top
R93  147.07,5.84 90 top
R94  47.5,19.05 90 top
R95  44.96,19.05 270 top
R96  50.55,19.05 90 top
R97  53.09,19.05 270 top
R98  65.28,19.05 90 top
R99  62.74,19.05 270 top
R100  68.33,19.05 90 top
R101  70.87,19.05 270 top
R102  83.06,19.05 90 top
R103  80.52,19.05 270 top
R104  86.11,19.05 90 top
R105  88.65,19.05 270 top
R106  100.84,19.05 90 top
R107  98.3,19.05 270 top
R108  103.89,19.05 90 top
R109  106.43,19.05 270 top
R110  118.62,19.05 90 top
R111  116.08,19.05 270 top
R112  121.67,19.05 90 top
R113  124.21,19.05 270 top
R114  136.4,19.05 90 top
R115  133.86,19.05 270 top
R116  139.45,19.05 90 top
R117  141.99,19.05 270 top
R118  19.81,45.97 0 top
R119  16.26,45.97 0 top
R120  12.7,45.97 0 top
R121  9.14,45.97 0 top
R122  19.81,39.62 180 top
R123  16.26,39.62 180 top
R124  12.7,39.62 180 top
R125  9.14,39.62 180 top
R126  5.59,39.62 180 top
U1  42.93,42.93 90 top
U2  117.6,40.89 90 top

### Tracks (layer width: path | path; a pad name or v marks a point on that pad's centre or on a via)
A1_DIG1
  Top 0.254: JP1.2 13.46,15.75 R46.1
  Top 0.406: R47.2 R46.1
A1_DIG2
  Top 0.254: R50.1 29.72,16 31.5,14.22 JP3.2
  Top 0.406: R51.2 R50.1
A1_DIG3
  Top 0.254: JP4.2 49.28,14.22 47.5,16 R94.1
  Top 0.406: R95.2 46.63,17.63 46.74,17.53 47.4,17.53 R94.1
A1_DIG4
  Top 0.254: JP5.2 67.31,14.22 65.28,16.26 R98.1
  Top 0.406: R99.2 R98.1
A1_DIG5
  Top 0.254: JP6.2 85.09,14.22 83.06,16.26 R102.1
  Top 0.406: R103.2 R102.1
A1_DIG6
  Top 0.254: JP7.2 102.62,14.22 100.84,16 R106.1
  Top 0.406: R107.2 R106.1
A1_DIG7
  Top 0.254: JP8.2 120.4,14.22 118.62,16 R110.1
  Top 0.406: R111.2 R110.1
A1_DIG8
  Top 0.254: JP9.2 138.18,14.22 136.4,16 R114.1
  Top 0.406: R115.2 R114.1
A1_SEL#_DIG1
  Top 0.254: U1.35 31.14,46.13 21.34,36.32 16.87,36.32 R15.1
A1_SEL#_DIG2
  Top 0.254: U1.42 35.45,40.53 26.42,31.5 26.42,29.82 R19.1
A1_SEL#_DIG3
  Top 0.254: U1.5 42.13,31.79 43.69,30.23 43.69,30.07 R23.1
A1_SEL#_DIG4
  Top 0.254: U1.12 59.63,38.93 61.72,36.83 61.72,29.82 R27.1
A1_SEL#_DIG5
  Top 0.254: U1.19 66.22,44.53 79.5,31.24 79.5,29.82 R31.1
A1_SEL#_DIG6
  Top 0.254: U2.38 107.73,41.69 97.54,31.5 97.54,29.87 R35.1
A1_SEL#_DIG7
  Top 0.254: U2.1 113.6,33.21 115.06,31.75 115.06,29.82 R39.1
A1_SEL#_DIG8  (via drill 0.41)
  Top 0.254: U2.8 119.2,38.79 v118.87,39.12 | R43.1 132.94,29.87 132.84,29.97 v132.84,33.27
  Bottom 0.254: v132.84,33.27 124.71,33.27 v118.87,39.12
A2_DIG1
  Top 0.254: JP1.3 16.26,12.95 16.26,17.63 R48.1
  Top 0.406: R48.1 R49.2
A2_DIG2
  Top 0.254: JP3.3 34.04,12.95 34.04,17.63
  Top 0.406: R52.1 34.04,17.63 R53.2
A2_DIG3
  Top 0.254: JP4.3 51.82,12.95 51.82,17.63
  Top 0.406: R96.1 51.82,17.63 R97.2
A2_DIG4
  Top 0.254: JP5.3 69.6,12.95 69.6,17.63
  Top 0.406: R101.2 69.6,17.63 R100.1
A2_DIG5
  Top 0.254: JP6.3 87.38,12.95 87.38,17.63
  Top 0.406: R104.1 87.38,17.63 R105.2
A2_DIG6
  Top 0.254: JP7.3 105.16,12.95 105.16,17.37 104.9,17.63
  Top 0.406: R108.1 104.9,17.63 R109.2
A2_DIG7
  Top 0.254: JP8.3 122.94,12.95 122.94,17.63
  Top 0.406: R112.1 122.94,17.63 R113.2
A2_DIG8
  Top 0.254: JP9.3 140.72,12.95 140.72,17.63
  Top 0.406: R116.1 140.72,17.63 R117.2
A2_SEL#_DIG1
  Top 0.254: U1.36 31.36,45.33 17.02,30.99 17.02,29.87 R17.1
A2_SEL#_DIG2
  Top 0.254: U1.43 35.92,39.73 33.02,36.83 33.02,29.82 R21.1
A2_SEL#_DIG3
  Top 0.254: U1.6 42.93,32.51 44.2,31.24 49.63,31.24 R25.1
A2_SEL#_DIG4
  Top 0.254: U1.13 60.6,39.73 68.83,31.5 68.83,29.82 R29.1
A2_SEL#_DIG5
  Top 0.254: U1.20 72.78,45.33 86.61,31.5 86.61,29.82 R33.1
A2_SEL#_DIG6
  Top 0.254: U2.39 109.47,40.89 104.65,36.07 104.65,29.87 R37.1
A2_SEL#_DIG7
  Top 0.254: U2.2 114.4,33.43 116.59,31.24 120.24,31.24 R41.1
A2_SEL#_DIG8  (via drill 0.41)
  Top 0.254: U2.9 120,39.76 v119.63,40.13 | R45.1 140.06,33.93 v139.95,34.04
  Bottom 0.254: v139.95,34.04 125.73,34.04 v119.63,40.13
CLK  (via drill 0.41)
  Top 0.254: Q18.1 17.21,45.87 R119.2 17.02,46.06 v17.02,46.74
  Bottom 0.254: JP10.6 17.53,47.24 v17.02,46.74
CLK_HV  (via drill 0.41)
  Top 0.254: R123.2 15.41,40.72 Q18.3 16.85,41.57 v17.02,41.4 | U1.29 42.13,46.7 v42.16,46.48 | U2.29 116.8,44.49 v116.84,44.45
  Bottom 0.254: v17.02,41.4 19.3,41.4 24.89,46.99 41.66,46.99 v42.16,46.48 114.81,46.48 v116.84,44.45
DATA_IN  (via drill 0.41)
  Top 0.254: Q17.1 20.76,45.87 R118.2 20.57,46.06 v20.57,46.74
  Bottom 0.254: JP10.7 20.07,47.24 v20.57,46.74
DATA_IN_HV  (via drill 0.41)
  Top 0.254: R122.2 18.96,40.72 Q17.3 20.4,41.57 v20.57,41.4 | U1.33 38.93,46.29 v38.86,46.23
  Bottom 0.254: v38.86,46.23 25.15,46.23 v20.57,41.4
DATA_OUT
  Top 0.254: R126.2 4.74,40.72 Q21.3
DATA_OUT1_HV
  Top 0.254: 113.56,46.74 U2.33 113.54,46.76 113.54,48.01 112.27,49.28 46.99,49.28 46.93,49.21 U1.23
DATA_OUT2_HV  (via drill 0.41)
  Top 0.254: U2.23 v121.6,48.51 | Q21.1 6.54,46.67 7.62,47.75 v22.86,47.75
  Bottom 0.254: v22.86,47.75 23.62,48.51 v121.6,48.51
GND  (via drill 0.41)
  other vias: 2.54,35.05 2.54,51.56 2.54,15.75 83.82,51.56 163.83,51.56 71.63,42.67 76.96,37.59 82.55,32 80.01,34.8 74.42,40.39 92.71,34.29 84.84,42.42 101.09,42.42 92.71,42.42 88.9,38.61 97.03,38.61 57.91,37.08 59.94,35.31 54.61,37.08 51.31,37.08 35.05,36.07 35.05,33.02 30.48,42.42 27.18,38.86 20.57,32.51 23.88,35.81 15.75,32.51 18.03,34.8 30.23,32.51 64.26,33.02 70.1,33.02 67.31,35.81 64.52,38.61 77.72,42.67 79.76,40.39 82.8,37.59 85.34,34.8 88.39,32 102.62,34.29 106.43,34.29 101.35,32
  pour Bottom: 0,0 166.37,0 166.37,54.1 0,54.1
  pour Top: 0,0 166.37,0 166.37,54.1 0,53.85
HV_IN
  Top 0.406: R3.1 R5.1 R1.1 149.1,45.21 150.37,43.94 JP2.2
HV_VBA  (via drill 0.41)
  Top 0.406: v140.97,27.18 R44.2 140.53,26.71 Q16.2 | v133.86,27.18 R42.2 133.42,26.71 Q15.2 | v122.68,27.18 R40.2 122.49,26.45 Q14.2 | v116.08,27.18 R38.2 115.64,26.71 Q13.2 | v105.41,27.18 R36.2 104.97,26.71 Q12.2 | v98.3,27.18 R34.2 97.86,26.71 Q11.2 | v87.63,27.18 R32.2 87.19,26.71 Q10.2 | v80.52,27.18 R30.2 80.08,26.71 Q9.2 | v69.85,27.18 R28.2 69.41,26.71 Q8.2 | v62.74,27.18 R26.2 62.3,26.71 Q7.2 | v52.07,27.18 R24.2 51.63,26.71 Q6.2 | v44.96,27.18 R22.2 44.52,26.71 Q5.2 | v34.04,27.18 R20.2 33.59,26.71 Q4.2 | v27.43,27.18 R18.2 26.99,26.71 Q3.2 | v17.78,27.18 R16.2 17.34,26.71 Q2.2 | v11.18,27.18 R14.2 10.73,26.71 Q1.2 | v145.03,42.16 R5.2 145.03,36.83 v140.97,32.77
  Bottom 0.406: v11.18,27.18 v17.78,27.18 v27.43,27.18 v34.04,27.18 v44.96,27.18 v52.07,27.18 v62.74,27.18 v69.85,27.18 v80.52,27.18 v87.63,27.18 v98.3,27.18 v105.41,27.18 v116.08,27.18 v122.68,27.18 v133.86,27.18 v140.97,27.18 v140.97,32.77 | JP12.2 146.3,43.43 v145.03,42.16
HV_VBA_OFF  (via drill 0.41)
  Top 0.406: D8.3 v137.92,29.72 137.92,41.15 | D7.3 v119.89,29.72 | D6.3 v102.36,29.72 | D5.3 v84.58,29.72 | D4.3 v66.8,29.72 | D3.3 v49.02,29.72 | D2.3 v31.24,29.72 | D1.3 v14.99,29.72 | 137.92,41.15 R4.2 v136.91,42.16 | R3.2 137.93,41.14 137.92,41.15
  Bottom 0.406: v137.92,29.72 v119.89,29.72 v102.36,29.72 v84.58,29.72 v66.8,29.72 v49.02,29.72 v31.24,29.72 v14.99,29.72 | JP11.2 138.18,43.43 v136.91,42.16
HV_VS  (via drill 0.41)
  Top 0.406: R89.1 R91.1 R90.1 R93.1 R92.1 153.16,7.98 R2.2 | R89.1 R13.2 | R87.1 v130.81,4.42 R88.1 R85.1 R86.1 R84.1 v120.14,4.42 R12.2 | R11.2 v102.36,4.42 R79.1 R81.1 R80.1 R83.1 v112.78,4.42 R82.1 | R10.2 v84.58,4.42 R74.1 R76.1 R75.1 R78.1 v95,4.42 R77.1 | R9.2 v66.8,4.42 R69.1 R71.1 R70.1 R73.1 v77.22,4.42 R72.1 | R67.1 60.3,4.42 60.2,4.32 59.54,4.32 | 59.54,4.32 58.27,4.32 R68.1 R65.1 R66.1 R64.1 v49.02,4.42 R8.2 | R7.2 v31.24,4.42 R59.1 R61.1 R60.1 R63.1 v41.66,4.42 R62.1 | R6.2 R54.1 R56.1 R55.1 R58.1 v23.88,4.42 R57.1 | R89.1 138.28,4.42 v138.18,4.32 | 59.54,4.32 v59.44,4.42 | v153.16,42.16 R2.2 | R1.2 R2.2
  Bottom 0.406: v138.18,4.32 138.18,4.42 v130.81,4.42 | v23.88,4.42 v31.24,4.42 | v41.66,4.42 v49.02,4.42 | v59.44,4.42 v66.8,4.42 | v77.22,4.42 v84.58,4.42 | v95,4.42 v102.36,4.42 | v112.78,4.42 v120.14,4.42 | JP13.2 154.43,43.43 v153.16,42.16
K01_DIG1  (via drill 0.41)
  Top 0.254: U1.37 34.87,44.53 22.35,32 22.35,16.76 20.07,14.48 JP1.6 | v14.99,8.13 R54.2
  Bottom 0.254: JP1.6 18.8,12.95 18.8,10.92 16.76,8.89 15.75,8.89 v14.99,8.13
K01_DIG2  (via drill 0.41)
  Top 0.254: U1.44 37.13,38.9 37.08,38.86 37.08,32.26 37.85,31.5 JP3.6 | R59.2 v32.77,8.13
  Bottom 0.254: v32.77,8.13 35.05,10.41 35.81,10.41 36.58,11.18 36.58,12.95 JP3.6
K01_DIG3  (via drill 0.41)
  Top 0.254: JP4.6 55.63,31.24 54.61,32.26 44.7,32.26 43.73,33.24 U1.7 | R64.2 v50.55,8.13
  Bottom 0.254: v50.55,8.13 52.58,10.16 53.59,10.16 54.36,10.92 54.36,12.95 JP4.6
K01_DIG4  (via drill 0.41)
  Top 0.254: JP5.6 73.41,32.26 65.14,40.53 U1.14 | R69.2 v68.33,8.13
  Bottom 0.254: v68.33,8.13 70.36,10.16 71.37,10.16 72.14,10.92 72.14,12.95 JP5.6
K01_DIG5  (via drill 0.41)
  Top 0.254: JP6.6 91.19,31.24 76.3,46.13 U1.21 | R74.2 v86.11,8.13
  Bottom 0.254: v86.11,8.13 88.14,10.16 89.15,10.16 89.92,10.92 89.92,12.95 JP6.6
K01_DIG6  (via drill 0.41)
  Top 0.254: U2.40 109.69,40.09 108.2,38.61 108.2,31.75 108.97,30.99 JP7.6 | R79.2 v103.89,8.13
  Bottom 0.254: v103.89,8.13 105.92,10.16 106.93,10.16 107.7,10.92 107.7,12.95 JP7.6
K01_DIG7  (via drill 0.41)
  Top 0.254: U2.3 115.2,33.64 116.84,32 124.97,32 126.75,30.23 JP8.6 | R84.2 v121.67,8.13
  Bottom 0.254: v121.67,8.13 123.7,10.16 124.71,10.16 125.48,10.92 125.48,12.95 JP8.6
K01_DIG8  (via drill 0.41)
  Top 0.254: U2.10 120.8,40.74 v120.4,41.15 | JP9.6 v144.53,34.8 | R89.2 v139.45,8.13
  Bottom 0.254: v144.53,34.8 126.64,34.8 120.8,40.64 120.8,40.74 v120.4,41.15 | v139.45,8.13 141.48,10.16 142.49,10.16 143.26,10.92 143.26,12.95 JP9.6
K23_DIG1  (via drill 0.41)
  Top 0.254: U1.38 34.84,43.73 22.86,31.75 22.86,16.51 21.34,14.99 21.34,12.95 JP1.7 | v20.07,8.13 R55.2
  Bottom 0.254: JP1.7 22.61,10.92 20.07,8.38 v20.07,8.13
K23_DIG2  (via drill 0.41)
  Top 0.254: U1.1 38.93,14.92 39.12,14.73 39.12,12.95 JP3.7 | R60.2 v37.85,8.13
  Bottom 0.254: v37.85,8.13 40.39,10.67 JP3.7
K23_DIG3  (via drill 0.41)
  Top 0.254: JP4.7 56.9,12.95 56.9,31.24 55.12,33.02 45.21,33.02 44.53,33.71 U1.8 | R65.2 v55.63,8.13
  Bottom 0.254: v55.63,8.13 58.17,10.67 JP4.7
K23_DIG4  (via drill 0.41)
  Top 0.254: JP5.7 74.68,12.95 74.68,14.99 74.17,15.49 74.17,32.51 65.35,41.33 U1.15 | R70.2 v73.41,8.13
  Bottom 0.254: v73.41,8.13 75.95,10.67 JP5.7
K23_DIG5  (via drill 0.41)
  Top 0.254: JP6.7 92.46,12.95 92.46,14.99 91.95,15.49 91.95,31.75 76.77,46.93 U1.22 | R75.2 v91.19,8.13
  Bottom 0.254: v91.19,8.13 93.73,10.67 JP6.7
K23_DIG6  (via drill 0.41)
  Top 0.254: U2.41 109.91,39.29 108.97,38.35 108.97,32 110.24,30.73 110.24,12.95 JP7.7 | R80.2 v108.97,8.13
  Bottom 0.254: v108.97,8.13 111.51,10.67 JP7.7
K23_DIG7  (via drill 0.41)
  Top 0.254: U2.4 116,33.86 117.09,32.77 125.22,32.77 127.51,30.48 127.51,15.49 128.02,14.99 128.02,12.95 JP8.7 | R85.2 v126.75,8.13
  Bottom 0.254: v126.75,8.13 129.29,10.67 JP8.7
K23_DIG8  (via drill 0.41)
  Top 0.254: JP9.7 145.8,12.95 v145.8,35.81 | v126.75,35.81 126.24,35.31 121.81,35.31 U2.11 | R90.2 v144.53,8.13
  Bottom 0.254: v145.8,35.81 v126.75,35.81 | v144.53,8.13 147.07,10.67 JP9.7
K45_DIG1  (via drill 0.41)
  Top 0.254: U1.39 34.8,42.93 23.37,31.5 23.37,14.99 JP1.8 | v17.53,8.13 R56.2
  Bottom 0.254: JP1.8 21.34,12.95 21.34,10.92 19.3,8.89 18.29,8.89 v17.53,8.13
K45_DIG2  (via drill 0.41)
  Top 0.254: U1.2 39.73,14.88 JP3.8 | R61.2 v35.31,8.13
  Bottom 0.254: v35.31,8.13 37.59,10.41 38.35,10.41 39.12,11.18 39.12,12.95 JP3.8
K45_DIG3  (via drill 0.41)
  Top 0.254: JP4.8 58.17,31.24 55.63,33.78 45.97,33.78 45.33,34.43 U1.9 | R66.2 v53.09,8.13
  Bottom 0.254: v53.09,8.13 55.12,10.16 56.13,10.16 56.9,10.92 56.9,12.95 JP4.8
K45_DIG4  (via drill 0.41)
  Top 0.254: JP5.8 75.95,14.99 74.93,16 74.93,32.77 65.53,42.16 65.49,42.13 U1.16 | R71.2 v70.87,8.13
  Bottom 0.254: v70.87,8.13 72.9,10.16 74.17,10.16 74.68,10.67 74.68,12.95 JP5.8
K45_DIG5  (via drill 0.41)
  Top 0.254: JP6.8 93.73,32 105.82,44.09 U2.35 | R76.2 v88.65,8.13
  Bottom 0.254: v88.65,8.13 90.68,10.16 91.69,10.16 92.46,10.92 92.46,12.95 JP6.8
K45_DIG6  (via drill 0.41)
  Top 0.254: U2.42 110.38,38.49 109.73,37.85 109.73,32.26 111.51,30.48 JP7.8 | R81.2 v106.43,8.13
  Bottom 0.254: v106.43,8.13 108.46,10.16 109.47,10.16 110.24,10.92 110.24,12.95 JP7.8
K45_DIG7  (via drill 0.41)
  Top 0.254: U2.5 116.8,34.07 117.35,33.53 125.48,33.53 128.27,30.73 128.27,16.51 129.29,15.49 JP8.8 | R86.2 v124.21,8.13
  Bottom 0.254: v124.21,8.13 126.24,10.16 127.25,10.16 128.02,10.92 128.02,12.95 JP8.8
K45_DIG8  (via drill 0.41)
  Top 0.254: JP9.8 v147.07,36.58 | U2.12 127.19,36.89 v127.51,36.58 | R91.2 v141.99,8.13
  Bottom 0.254: v147.07,36.58 v127.51,36.58 | v141.99,8.13 141.99,8.38 143.76,10.16 145.03,10.16 145.8,10.92 145.8,12.95 JP9.8
K67_DIG1  (via drill 0.41)
  Top 0.254: U1.40 34.76,42.13 23.88,31.24 23.88,12.95 JP1.9 | v25.15,8.13 R57.2
  Bottom 0.254: JP1.9 v25.15,8.13
K67_DIG2  (via drill 0.41)
  Top 0.254: U1.3 40.53,16.12 41.66,14.99 41.66,12.95 JP3.9 | R62.2 v42.93,8.13
  Bottom 0.254: v42.93,8.13 JP3.9
K67_DIG3  (via drill 0.41)
  Top 0.254: JP4.9 59.44,12.95 59.44,31.24 56.13,34.54 46.48,34.54 46.13,34.9 U1.10 | R67.2 v60.71,8.13
  Bottom 0.254: v60.71,8.13 JP4.9
K67_DIG4  (via drill 0.41)
  Top 0.254: JP5.9 77.22,12.95 77.22,14.99 75.69,16.51 75.69,33.02 65.79,42.93 U1.17 | R72.2 v78.49,8.13
  Bottom 0.254: v78.49,8.13 JP5.9
K67_DIG5  (via drill 0.41)
  Top 0.254: JP6.9 95,12.95 95,14.99 94.49,15.49 94.49,31.5 106.29,43.29 U2.36 | R77.2 v96.27,8.13
  Bottom 0.254: v96.27,8.13 JP6.9
K67_DIG6  (via drill 0.41)
  Top 0.254: JP7.9 112.78,12.95 112.78,15.24 112.52,15.49 112.52,30.48 110.49,32.51 110.49,37.34 110.85,37.69 U2.43 | R82.2 v114.05,8.13
  Bottom 0.254: v114.05,8.13 JP7.9
K67_DIG7  (via drill 0.41)
  Top 0.254: U2.6 117.6,36.83 v117.35,37.08 | JP8.9 130.56,12.95 130.56,15.49 129.03,17.02 v129.03,31.5 | R87.2 v131.83,8.13
  Bottom 0.254: v129.03,31.5 122.94,31.5 v117.35,37.08 | v131.83,8.13 JP8.9
K67_DIG8  (via drill 0.41)
  Top 0.254: JP9.9 148.34,12.95 v148.34,37.34 | U2.13 127.91,37.69 v128.27,37.34 | R92.2 v149.61,8.13
  Bottom 0.254: v148.34,37.34 v128.27,37.34 | v149.61,8.13 JP9.9
K89_DIG1  (via drill 0.41)
  Top 0.254: U1.41 34.72,41.33 24.38,30.99 24.38,14.99 JP1.10 | v22.61,8.13 R58.2
  Bottom 0.254: JP1.10 25.15,13.72 23.88,12.45 23.88,9.4 v22.61,8.13
K89_DIG2  (via drill 0.41)
  Top 0.254: U1.4 41.33,17.09 42.93,15.49 JP3.10 | R63.2 v40.39,8.13
  Bottom 0.254: v40.39,8.13 41.66,9.4 41.66,12.95 JP3.10
K89_DIG3  (via drill 0.41)
  Top 0.254: JP4.10 60.71,31.24 56.64,35.31 48.26,35.31 46.93,36.64 U1.11 | R68.2 v58.17,8.13
  Bottom 0.254: v58.17,8.13 59.18,9.14 59.18,12.7 JP4.10
K89_DIG4  (via drill 0.41)
  Top 0.254: JP5.10 78.49,14.73 76.45,16.76 76.45,33.27 66,43.73 U1.18 | R73.2 v75.95,8.13
  Bottom 0.254: v75.95,8.13 77.22,9.4 77.22,12.95 JP5.10
K89_DIG5  (via drill 0.41)
  Top 0.254: JP6.10 96.27,14.99 95.25,16 95.25,30.99 106.76,42.49 U2.37 | R78.2 v93.73,8.13
  Bottom 0.254: v93.73,8.13 95,9.4 95,12.95 JP6.10
K89_DIG6  (via drill 0.41)
  Top 0.254: JP7.10 114.05,24.89 113.28,25.65 113.28,30.73 111.76,32.26 111.76,36.85 U2.44 | R83.2 v111.51,8.13
  Bottom 0.254: v111.51,8.13 112.78,9.4 112.78,12.95 JP7.10
K89_DIG7  (via drill 0.41)
  Top 0.254: U2.7 118.4,37.81 v118.11,38.1 | JP8.10 131.83,15.49 130.3,17.02 v130.3,32.51 | R88.2 v129.29,8.13
  Bottom 0.254: v130.3,32.51 123.7,32.51 v118.11,38.1 | v129.29,8.13 130.56,9.4 130.56,12.95 JP8.10
K89_DIG8  (via drill 0.41)
  Top 0.254: JP9.10 v149.61,38.1 | U2.14 128.64,38.49 v129.03,38.1 | R93.2 v147.07,8.13
  Bottom 0.254: v149.61,38.1 v129.03,38.1 | v147.07,8.13 148.34,9.4 148.34,12.95 JP9.10
N$1
  Top 0.406: R15.2 R14.1 12.63,26.71 Q1.1
N$2
  Top 0.406: Q2.1 19.24,26.71 R16.1 R17.2
N$3
  Top 0.406: R19.2 R18.1 28.89,26.71 Q3.1
N$4
  Top 0.406: Q4.1 35.49,26.71 R20.1 R21.2
N$5
  Top 0.406: R23.2 R22.1 46.42,26.71 Q5.1
N$6
  Top 0.406: Q6.1 53.53,26.71 R24.1 R25.2
N$7
  Top 0.406: R27.2 R26.1 64.2,26.71 Q7.1
N$8
  Top 0.406: Q8.1 71.31,26.71 R28.1 R29.2
N$9
  Top 0.406: R30.1 82.45,27.69 | 82.45,27.69 R31.2 | Q9.1 81.98,27.21 82.45,27.69
N$10
  Top 0.406: Q10.1 89.09,26.71 R32.1 R33.2
N$11
  Top 0.406: R35.2 R34.1 99.76,26.71 Q11.1
N$12
  Top 0.406: Q12.1 106.87,26.71 R36.1 R37.2
N$13
  Top 0.406: Q13.1 117.54,26.71 R38.1 R39.2
N$14
  Top 0.406: R41.2 R40.1 124.39,26.89 Q14.1
N$15
  Top 0.406: R43.2 R42.1 135.32,26.71 Q15.1
N$16
  Top 0.406: Q16.1 142.43,26.71 R44.1 R45.2
N$17
  Top 0.406: R47.1 10.92,22.01 Q1.3
N$18
  Top 0.406: R46.2 13.46,22.2 D1.1
N$19
  Top 0.406: R49.1 19.05,22.01 Q2.3
N$20
  Top 0.406: R48.2 16.51,22.2 D1.2
N$21
  Top 0.406: R51.1 27.18,21.76 Q3.3
N$22
  Top 0.406: R50.2 29.72,21.95 D2.1
N$24
  Top 0.406: R53.1 35.31,21.76 Q4.3
N$25
  Top 0.406: R52.2 32.77,21.95 D2.2
N$26
  Top 0.406: R94.2 47.5,22.2 D3.1
N$27
  Top 0.406: R96.2 50.55,22.2 D3.2
N$28
  Top 0.406: R98.2 65.28,22.2 D4.1
N$29
  Top 0.406: R100.2 68.33,22.2 D4.2
N$30
  Top 0.406: R103.1 80.52,22.27 Q9.3
N$31
  Top 0.406: R102.2 83.06,22.2 D5.1
N$32
  Top 0.406: R104.2 86.11,22.2 D5.2
N$33
  Top 0.406: R106.2 100.84,22.2 D6.1
N$34
  Top 0.406: R108.2 103.89,22.2 D6.2
N$35
  Top 0.406: R111.1 116.08,22.27 Q13.3
N$36
  Top 0.406: R110.2 118.62,22.46 D7.1
N$37
  Top 0.406: R112.2 121.67,21.95 D7.2
N$38
  Top 0.406: R114.2 136.4,22.2 D8.1
N$39
  Top 0.406: R116.2 139.45,22.2 D8.2
N$41
  Top 0.406: R95.1 44.96,22.27 Q5.3
N$42
  Top 0.406: R97.1 53.09,22.27 Q6.3
N$43
  Top 0.406: R99.1 62.74,22.27 Q7.3
N$44
  Top 0.406: R101.1 70.87,22.27 Q8.3
N$45
  Top 0.406: R105.1 88.65,22.27 Q10.3
N$46
  Top 0.406: R107.1 98.3,22.27 Q11.3
N$47
  Top 0.406: R109.1 106.43,22.27 Q12.3
N$48
  Top 0.406: R113.1 124.21,22.01 Q14.3
N$49
  Top 0.406: R115.1 133.86,22.27 Q15.3
N$50
  Top 0.406: R117.1 141.99,22.27 Q16.3
OE  (via drill 0.41)
  Top 0.254: Q19.1 13.65,45.87 R120.2 13.46,46.06 v13.46,46.74
  Bottom 0.254: JP10.5 14.99,49.02 13.46,47.5 v13.46,46.74
OE_HV  (via drill 0.41)
  Top 0.254: R124.2 11.85,40.72 Q19.3 13.29,41.57 v13.46,41.4 | U1.28 v42.93,47.24 | U2.28 v117.6,45.21
  Bottom 0.254: v13.46,41.4 14.22,42.16 19.05,42.16 24.64,47.75 42.42,47.75 v42.93,47.24 115.57,47.24 v117.6,45.21
S_DIG1  (via drill 0.41)
  Top 0.254: v12.45,8.13 R6.1
  Bottom 0.254: JP1.4 16.26,12.95 16.26,10.92 14.22,8.89 13.21,8.89 v12.45,8.13
S_DIG2  (via drill 0.41)
  Top 0.254: v30.23,8.13 R7.1
  Bottom 0.254: JP3.4 34.04,12.95 34.04,11.18 33.02,10.16 32,10.16 v30.23,8.13
S_DIG3  (via drill 0.41)
  Top 0.254: R8.1 v48.01,8.13
  Bottom 0.254: v48.01,8.13 50.04,10.16 51.05,10.16 51.82,10.92 51.82,12.95 JP4.4
S_DIG4  (via drill 0.41)
  Top 0.254: R9.1 v65.79,8.13
  Bottom 0.254: v65.79,8.13 67.82,10.16 68.83,10.16 69.6,10.92 69.6,12.95 JP5.4
S_DIG5  (via drill 0.41)
  Top 0.254: R10.1 v83.57,8.13
  Bottom 0.254: v83.57,8.13 85.6,10.16 86.61,10.16 87.38,10.92 87.38,12.95 JP6.4
S_DIG6  (via drill 0.41)
  Top 0.254: R11.1 v101.35,8.13
  Bottom 0.254: v101.35,8.13 103.38,10.16 104.39,10.16 105.16,10.92 105.16,12.95 JP7.4
S_DIG7  (via drill 0.41)
  Top 0.254: R12.1 v119.13,8.13
  Bottom 0.254: v119.13,8.13 121.16,10.16 122.17,10.16 122.94,10.92 122.94,12.95 JP8.4
S_DIG8  (via drill 0.41)
  Top 0.254: R13.1 v136.91,8.13
  Bottom 0.254: v136.91,8.13 138.94,10.16 139.95,10.16 140.72,10.92 140.72,12.95 JP9.4
SPARE1
  Top 0.254: U2.16 126.28,40.09 126.75,39.62 128.78,39.62 JP14.1
SPARE2
  Top 0.254: U2.17 127.51,40.89 JP14.2
SPARE3
  Top 0.254: U2.18 126.28,41.69 127,42.42 129.03,42.42 JP14.3
SPARE4
  Top 0.254: U2.19 125.55,42.49 126.75,43.69 JP14.4
SPARE5
  Top 0.254: U2.20 125.34,43.29 127,44.96 129.03,44.96 JP14.5
SPARE6
  Top 0.254: U2.21 124.61,44.09 126.75,46.23 JP14.6
SPARE7
  Top 0.254: U2.22 123.89,44.89 126.49,47.5 129.03,47.5 JP14.7
STR  (via drill 0.41)
  Top 0.254: Q20.1 10.09,45.87 R121.2 9.91,46.06 v9.91,46.74
  Bottom 0.254: JP10.4 12.45,49.28 v9.91,46.74
STR_HV  (via drill 0.41)
  Top 0.254: R125.2 8.29,40.72 Q20.3 9.74,41.57 v9.91,41.4 | U1.32 39.73,45.31 v39.62,45.47 | U2.32 114.4,44.86 v114.3,44.7
  Bottom 0.254: v9.91,41.4 11.18,40.39 20.83,40.39 25.65,45.47 v39.62,45.47 39.88,45.72 113.28,45.72 v114.3,44.7
VCC  (via drill 0.41)
  Top 0.254: U2.31 115.2,43.83 v114.05,42.67 | U1.31 40.53,45.1 v39.62,44.2 | R122.1 20.66,38.77 v20.57,38.61 | R123.1 17.11,38.7 v17.02,38.61 | R124.1 13.55,38.77 v13.46,38.61 | R125.1 9.91,39.62 9.91,39.37 10.16,39.12 v10.16,38.61
  Bottom 0.254: v114.05,42.67 114.05,41.72 C4.1 | 39.62,43.11 C2.1 | v10.16,38.61 v13.46,38.61 v17.02,38.61 v20.57,38.61
  Bottom 0.406: JP10.2 7.37,49.28 8.38,48.26 8.38,40.39 v10.16,38.61 | v20.57,38.61 22.35,40.39 C1.1 C2.1 | C3.1 C4.1 | v114.05,42.67 112.52,44.2 v39.62,44.2 39.62,43.11
VDD  (via drill 0.41)
  Top 0.254: R126.1 6.44,38.7 v6.6,38.61
  Bottom 0.254: v6.6,38.61 4.83,40.13 JP10.1

### Text on the board
Document: www.andersknelson.com | Rev A